# EAGLE design F9P_Carrier_Board (EAGLE 9.6.2)
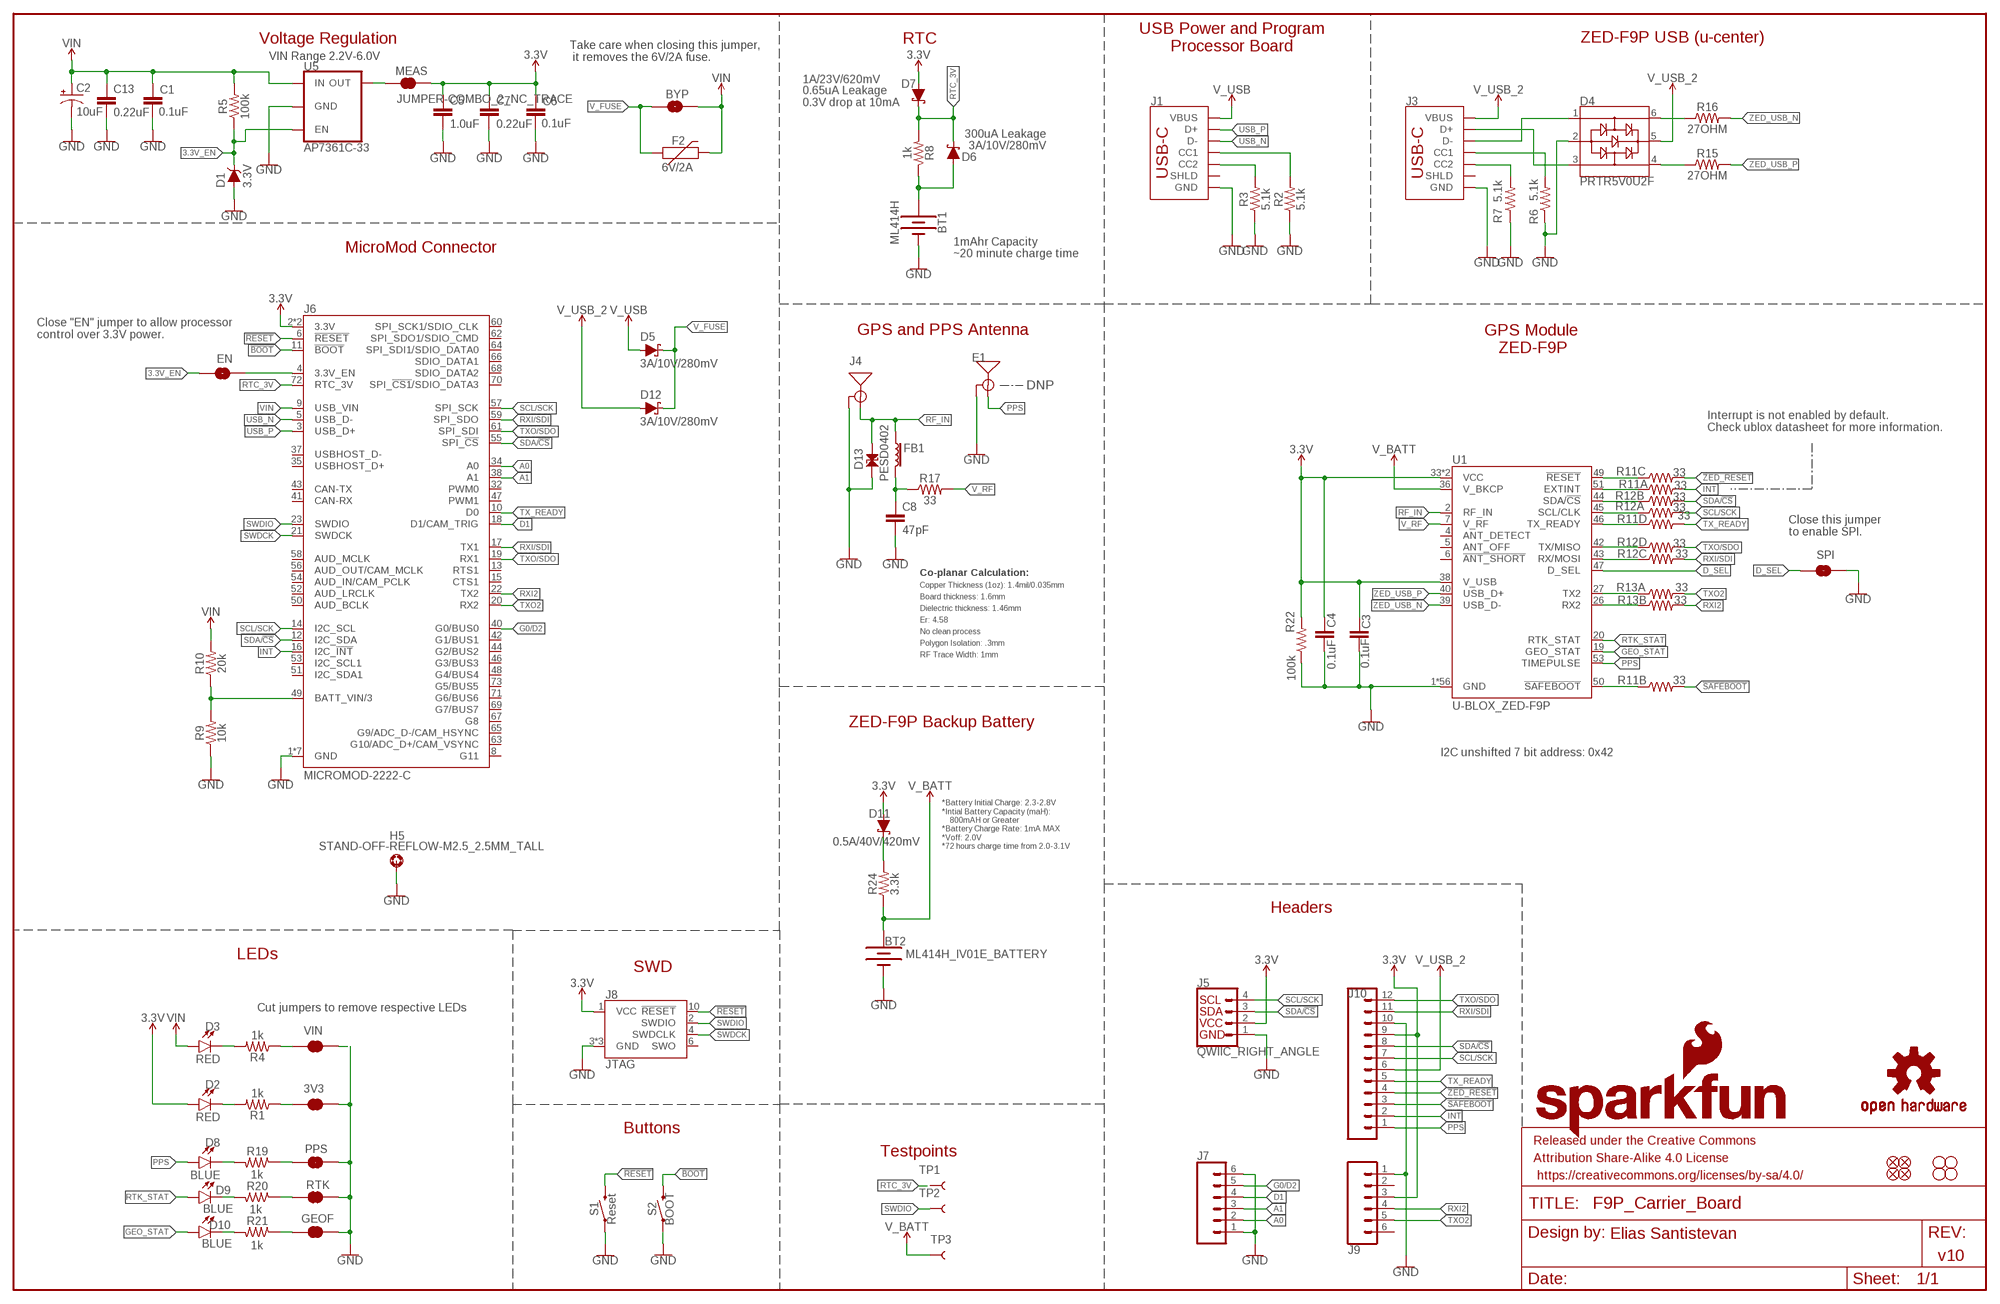
[diagram p0: schematic, sheet 1]

## Parts
3V3  JUMPER-SMT_2_NC_TRACE_SILK  [SMT-JUMPER_2_NC_TRACE_SILK]
BT1  ML414H  ML414H_IV01E_BATTERY  [ML414H_IV01E]
BT2  ML414H_IV01E_BATTERY  [ML414H_IV01E]
BYP  JUMPER-SMT_2_NO_SILK  [SMT-JUMPER_2_NO_SILK]
C1  0.1uF  0.1UF-0603-25V-(+80/-20%)  [0603]
C2  10uF  10UF-POLAR-EIA3216-16V-10%(TANT)  [EIA3216]
C3  0.1uF  0.1UF-0603-25V-5%  [0603]
C4  0.1uF  0.1UF-0603-25V-5%  [0603]
C5  1.0uF  1.0UF-0603-16V-10%  [0603]
C6  0.1uF  0.1UF-0603-25V-(+80/-20%)  [0603]
C7  0.22uF  0.22UF-0603-25V-10%  [0603]
C8  47pF  47PF-0603-50V-5%  [0603]
C13  0.22uF  0.22UF-0603-25V-10%  [0603]
D1  3.3V  DIODE-ZENER-MM3Z3V3T1G  [SOD-323]
D2  RED  LED-RED0603  [LED-0603]
D3  RED  LED-RED0603  [LED-0603]
D4  PRTR5V0U2F  [SOT886]
D5  3A/10V/280mV  DIODE-SCHOTTKY-BAT60A  [SOD-323]
D6  3A/10V/280mV  DIODE-SCHOTTKY-BAT60A  [SOD-323]
D7  1A/23V/620mV  DIODE-SCHOTTKY-BAT20J  [SOD-323]
D8  BLUE  LED-BLUE0603  [LED-0603]
D9  BLUE  LED-BLUE0603  [LED-0603]
D10  BLUE  LED-BLUE0603  [LED-0603]
D11  0.5A/40V/420mV  DIODE-SCHOTTKY-PMEG4005EJ  [SOD-323]
D12  3A/10V/280mV  DIODE-SCHOTTKY-BAT60A  [SOD-323]
D13  PESD0402  [0402]
E1  ANTENNA-SMA-GROUNDEDEDGE_SMA  [SMA-EDGE]
EN  JUMPER-SMT_2_NO_SILK  [SMT-JUMPER_2_NO_SILK]
F2  6V/2A  PPTC_6V2A  [1210]
FB1  FERRITE_BEAD-120_OHM-0402T  [0402-TIGHT]
FD1  FIDUCIALUFIDUCIAL  [FIDUCIAL-MICRO]
FD2  FIDUCIALUFIDUCIAL  [FIDUCIAL-MICRO]
FD3  FIDUCIALUFIDUCIAL  [FIDUCIAL-MICRO]
FD4  FIDUCIALUFIDUCIAL  [FIDUCIAL-MICRO]
FRAME1  FRAME-LEDGER  [CREATIVE_COMMONS]
GEOF  JUMPER-SMT_2_NC_TRACE_SILK  [SMT-JUMPER_2_NC_TRACE_SILK]
H1  STAND-OFFTIGHT  [STAND-OFF-TIGHT]
H2  STAND-OFFTIGHT  [STAND-OFF-TIGHT]
H3  STAND-OFFTIGHT  [STAND-OFF-TIGHT]
H4  STAND-OFFTIGHT  [STAND-OFF-TIGHT]
H5  STAND-OFF-REFLOW-M2.5_2.5MM_TALL  [STAND-OFF-REFLOW-M2.5]
J1  USB_C_2-LAYER_PADS  [USB-C-16P-2LAYER-PADS]
J3  USB_C_2-LAYER_PADS  [USB-C-16P-2LAYER-PADS]
J4  U.FL  ANTENNA-SMA-GROUNDEDEDGE_SMA  [SMA-EDGE]
J5  QWIIC_RIGHT_ANGLE  QWIIC_CONNECTORJS-1MM  [JST04_1MM_RA]
J6  MICROMOD-2222-C  [M.2-CONNECTOR-E]
J7  CONN_06NO_SILK_NO_POP  [1X06_NO_SILK]
J8  JTAG  CORTEX_JTAG_DEBUG_MINIMUM_PTH  [2X5-PTH-1.27MM]
J9  CONN_06NO_SILK_NO_POP  [1X06_NO_SILK]
J10  CONN_12NO_SILK  [1X12_NO_SILK]
LOGO1  SFE_LOGO_NAME_FLAME.3_INCH  [SFE_LOGO_NAME_FLAME_.3]
LOGO3  OSHW-LOGOMINI  [OSHW-LOGO-MINI]
MEAS  JUMPER-COMBO_2_NC_TRACE  [COMBO-JUMPER_2_NC_TRACE]
PPS  JUMPER-SMT_2_NC_TRACE_SILK  [SMT-JUMPER_2_NC_TRACE_SILK]
R1  1k  1KOHM-0603-1/10W-1%  [0603]
R2  5.1k  5.1KOHM5.1KOHM-0603-1/10W-1%  [0603]
R3  5.1k  5.1KOHM5.1KOHM-0603-1/10W-1%  [0603]
R4  1k  1KOHM-0603-1/10W-1%  [0603]
R5  100k  100KOHM-0603-1/10W-1%  [0603]
R6  5.1k  5.1KOHM5.1KOHM-0603-1/10W-1%  [0603]
R7  5.1k  5.1KOHM5.1KOHM-0603-1/10W-1%  [0603]
R8  1k  1KOHM-0603-1/10W-1%  [0603]
R9  10k  10KOHM-0603-1/10W-1%  [0603]
R10  20k  20KOHM-0603-1/10W-1%  [0603]
R11  33  33OHM_RA-1206-1/16W-5%  [1206_RA]
R12  33  33OHM_RA-1206-1/16W-5%  [1206_RA]
R13  33  33OHM_RA-1206-1/16W-5%  [1206_RA]
R15  27OHM  [0402-TIGHT]
R16  27OHM  [0402-TIGHT]
R17  33  33OHM-0603-1/10W-1%  [0603]
R19  1k  1KOHM-0603-1/10W-1%  [0603]
R20  1k  1KOHM-0603-1/10W-1%  [0603]
R21  1k  1KOHM-0603-1/10W-1%  [0603]
R22  100k  100KOHM-0603-1/10W-1%  [0603]
R24  3.3k  3.3KOHM-0603-1/10W-1%  [0603]
RTK  JUMPER-SMT_2_NC_TRACE_SILK  [SMT-JUMPER_2_NC_TRACE_SILK]
S1  Reset  MOMENTARY-SWITCH-SPST-SMD-5.2-TALL-REDUNDANT  [TACTILE_SWITCH_SMD_5.2MM]
S2  BOOT  MOMENTARY-SWITCH-SPST-SMD-5.2-TALL-REDUNDANT  [TACTILE_SWITCH_SMD_5.2MM]
SPI  JUMPER-SMT_2_NO_SILK  [SMT-JUMPER_2_NO_SILK]
TP1  TEST-POINT3X5  [PAD.03X.05]
TP2  TEST-POINT3X5  [PAD.03X.05]
TP3  TEST-POINT3X5  [PAD.03X.05]
U1  U-BLOX_ZED-F9P  [ZED-F9P]
U5  AP7361C-33  AP7361C-33FGEUDFN-8  [UDFN-8]
VIN  JUMPER-SMT_2_NC_TRACE_SILK  [SMT-JUMPER_2_NC_TRACE_SILK]

## Nets
3.3V: C3.1 C4.1 C5.1 C6.1 C7.1 D2.A D7.A D11.A J5.2 J6.2(3.3V) J6.74(3.3V) J8.1(VCC) J9.3 J10.9 MEAS.2 MEAS.4 R22.2 U1.33(VCC) U1.34(VCC) U1.38(V_USB)
3.3V_EN: D1.C EN.1 R5.1 U5.5(EN)
!BOOT!: J6.11(!BOOT!) S2.3 S2.4
!RESET!: J6.6(!RESET!) J8.10(!RESET) S1.3 S1.4
!SAFEBOOT!: J10.3 R11.P7
!ZED_RESET!: J10.4 R11.P6
A0: J6.34(A0) J7.2
A1: J6.38(A1) J7.3
D1: J6.18(D1/CAM_TRIG) J7.4
D_SEL: SPI.1 U1.47(D_SEL)
G0/D2: J6.40(G0/BUS0) J7.5
GEO_STAT: D10.A U1.19(GEO_STAT)
GND: 3V3.2 BT1.- BT2.- C1.2 C2.- C3.2 C4.2 C5.2 C6.2 C7.2 C8.2 C13.2 D1.A D4.2 D13.1 E1.GND@0(GND) E1.GND@1(GND) E1.GND@2(GND) E1.GND@3(GND) GEOF.1 H5.1 J1.GND J1.GND2(GND) J3.GND J3.GND2(GND) J4.GND@0(GND) J4.GND@1(GND) J4.GND@2(GND) J4.GND@3(GND) J5.1 J6.1(GND) J6.7(GND) J6.33(GND) J6.36(GND) J6.39(GND) J6.45(GND) J6.75(GND) J7.1 J7.6 J8.3(GND) J8.5(GND) J8.9(GND) J9.1 J10.10 PPS.1 R2.1 R3.1 R6.1 R7.1 R9.1 R22.1 RTK.1 S1.1 S1.2 S2.1 S2.2 SPI.2 U1.1(GND) U1.3(GND) U1.12(GND) U1.14(GND) U1.32(GND) U1.37(GND) U1.41(GND) U1.48(GND) U1.55(GND) U1.56(GND) U1.57(GND) U1.58(GND) U1.59(GND) U1.60(GND) U1.61(GND) U1.62(GND) U1.63(GND) U1.64(GND) U1.65(GND) U1.66(GND) U1.67(GND) U1.68(GND) U1.69(GND) U1.70(GND) U1.71(GND) U1.72(GND) U1.73(GND) U1.74(GND) U1.75(GND) U1.76(GND) U1.77(GND) U1.78(GND) U1.79(GND) U1.80(GND) U1.81(GND) U1.82(GND) U1.83(GND) U1.84(GND) U1.85(GND) U1.86(GND) U1.87(GND) U1.88(GND) U1.89(GND) U1.90(GND) U1.91(GND) U1.92(GND) U1.93(GND) U1.94(GND) U1.95(GND) U1.96(GND) U1.97(GND) U1.98(GND) U1.99(GND) U1.100(GND) U1.101(GND) U1.102(GND) U5.4(GND) U5.EP(GND) VIN.2
INT: J6.16(I2C_!INT!) J10.2 R11.P8
N$1: D2.C R1.2
N$2: R4.1 VIN.1
N$3: 3V3.1 R1.1
N$4: D3.C R4.2
N$5: EN.2 J6.4(3.3V_EN)
N$6: J3.A5(CC1) R6.2
N$7: J3.B5(CC2) R7.2
N$8: R20.1 RTK.2
N$9: D4.6 R16.1
N$10: J1.A5(CC1) R2.2
N$11: J1.B5(CC2) R3.2
N$12: D4.3 J3.A6(D+) J3.B6(D+)
N$13: D4.1 J3.A7(D-) J3.B7(D-)
N$14: BT1.+ D6.A R8.1
N$15: R11.P1 U1.51(EXTINT)
N$16: R11.P2 U1.50(!SAFEBOOT!)
N$17: D4.4 R15.1
N$18: C8.1 FB1.2 R17.1
N$19: R11.P3 U1.49(!RESET!)
N$20: R11.P4 U1.46(TX_READY)
N$21: R12.P1 U1.45(SCL/CLK)
N$22: R12.P2 U1.44(SDA/!CS!)
N$23: R12.P3 U1.43(RX/MOSI)
N$24: R12.P4 U1.42(TX/MISO)
N$25: R13.P1 U1.27(TX2)
N$26: R13.P2 U1.26(RX2)
N$27: PPS.2 R19.1
N$28: D8.C R19.2
N$29: D9.C R20.2
N$32: D11.C R24.2
N$45: GEOF.2 R21.1
N$46: D10.C R21.2
OUT_MEAS: MEAS.1 MEAS.3 U5.1(OUT)
PPS: D8.A E1.SIG(SIGNAL) J10.1 U1.53(TIMEPULSE)
RF_IN [Antenna]: D13.2 FB1.1 J4.SIG(SIGNAL) U1.2(RF_IN)
RTC_3V: D6.C D7.C J6.72(RTC_3V) R8.2 TP1.1
RTK_STAT: D9.A U1.20(RTK_STAT)
RXI2: J6.22(TX2) J9.4 R13.P7
RXI/SDI: J6.17(TX1) J6.59(SPI_SDO) J10.11 R12.P6
SCL/SCK: J5.4 J6.14(I2C_SCL) J6.57(SPI_SCK) J10.7 R12.P8
SDA/!CS!: J5.3 J6.12(I2C_SDA) J6.55(SPI_!CS!) J10.8 R12.P7
SWDCK: J6.21(SWDCK) J8.4(SWDCLK)
SWDIO: J6.23(SWDIO) J8.2(SWDIO) TP2.1
TX_READY: J6.10(D0) J10.5 R11.P5
TXO2: J6.20(RX2) J9.5 R13.P8
TXO/SDO: J6.19(RX1) J6.61(SPI_SDI) J10.12 R12.P5
USB_N [Diff pairs]: J1.A7(D-) J1.B7(D-) J6.5(USB_D-)
USB_P [Diff pairs]: J1.A6(D+) J1.B6(D+) J6.3(USB_D+)
V_BATT: BT2.+ R24.1 TP3.1 U1.36(V_BKCP)
V_FUSE: BYP.1 D5.C D12.C F2.1
V_RF: R17.2 U1.7(V_RF)
V_USB: D5.A J1.VBUS1(VBUS) J1.VBUS2(VBUS)
V_USB_2: D4.5 D12.A J3.VBUS1(VBUS) J3.VBUS2(VBUS) J10.6
VIN: BYP.2 C1.1 C2.+ C13.1 D3.A F2.2 J6.9(USB_VIN) R5.2 R10.2 U5.8(IN)
VIN/3: J6.49(BATT_VIN/3) R9.2 R10.1
ZED_USB_N: R16.2 U1.39(USB_D-)
ZED_USB_P: R15.2 U1.40(USB_D+)
Unconnected: J1.SHLD1(SHLD) J1.SHLD2(SHLD) J1.SHLD3(SHLD) J1.SHLD4(SHLD) J3.SHLD1(SHLD) J3.SHLD2(SHLD) J3.SHLD3(SHLD) J3.SHLD4(SHLD) J6.8(G11) J6.13(RTS1) J6.15(CTS1) J6.32(PWM0) J6.35(USBHOST_D+) J6.37(USBHOST_D-) J6.41(CAN-RX) J6.42(G1/BUS1) J6.43(CAN-TX) J6.44(G2/BUS2) J6.46(G3/BUS3) J6.47(PWM1) J6.48(G4/BUS4) J6.50(AUD_BCLK) J6.51(I2C_SDA1) J6.52(AUD_LRCLK) J6.53(I2C_SCL1) J6.54(AUD_IN/CAM_PCLK) J6.56(AUD_OUT/CAM_MCLK) J6.58(AUD_MCLK) J6.60(SPI_SCK1/SDIO_CLK) J6.62(SPI_SDO1/SDIO_CMD) J6.63(G10/ADC_D+/CAM_VSYNC) J6.64(SPI_SDI1/SDIO_DATA0) J6.65(G9/ADC_D-/CAM_HSYNC) J6.66(SDIO_DATA1) J6.67(G8) J6.68(SDIO_DATA2) J6.69(G7/BUS7) J6.70(SPI_!CS1!/SDIO_DATA3) J6.71(G6/BUS6) J6.73(G5/BUS5) J8.6(SWO) J9.2 J9.6 R13.P3 R13.P4 R13.P5 R13.P6 U1.4(ANT_DETECT) U1.5(ANT_OFF) U1.6(!ANT_SHORT!)

## Notes on the sheet
- USB Power and Program
  Processor Board
- Voltage Regulation | RTC | ZED-F9P USB (u-center)
- VIN Range 2.2V-6.0V
- Take care when closing this jumper,
   it removes the 6V/2A fuse.
- 0.65uA Leakage
  0.3V drop at 10mA
- 300uA Leakage
- MicroMod Connector | 1mAhr Capacity
- ~20 minute charge time
- GPS and PPS Antenna
- Close "EN" jumper to allow processor
  control over 3.3V power.
- GPS Module 
  ZED-F9P
- DNP
- Interrupt is not enabled by default.
  Check ublox datasheet for more information.
- Close this jumper 
  to enable SPI.
- Co-planar Calculation:
- Copper Thickness (1oz): 1.4mil/0.035mm
- Board thickness: 1.6mm
- Dielectric thickness: 1.46mm
- Er: 4.58
- No clean process
- Polygon Isolation: .3mm
- RF Trace Width: 1mm
- ZED-F9P Backup Battery
- I2C unshifted 7 bit address: 0x42
- *Battery Initial Charge: 2.3-2.8V
  *Intial Battery Capacity (maH): 
      800mAH or Greater
  *Battery Charge Rate: 1mA MAX
  *Voff: 2.0V
  *72 hours charge time from 2.0-3.1V
- Headers
- LEDs
- SWD
- Cut jumpers to remove respective LEDs
- Buttons
- Testpoints
- 1k
- 1k
- Elias Santistevan
- 1k
- v10

## Library data of the parts
3V3 GEOF PPS RTK VIN = SparkFun-Jumpers:JUMPER-SMT_2_NC_TRACE: Normally closed trace jumper This jumper has a trace between two pads so it's normally closed (NC). Use a razor knife to open the connection. For best results follow the IPC guidelines for cutting traces: Cutout at least 0.063 mm (0.005 in). Remove all loose material to clean up the cut area. Seal the cut with an approved epoxy. Reapply solder to reclose the connection.
BT1 BT2 = SparkFun-Batteries:ML414H_IV01E_BATTERY: SEIKO ML414H-IV01E Reflowable Lithium Battery ML414H is a rechargeable, coin type battery with features such as Pb-free reflowable (Peak temperature: 260 C) and high temperature heat resistance. Battery Characteristics: 3.1V max voltage Voff is 2V 1mAH 3k series resistor with battery 72 hour charge time from 2.0-3.1V 2.3-2.8V initial charge; PROD_ID: BATT-14267
BYP EN SPI = SparkFun-Jumpers:JUMPER-SMT_2_NO: Normally open jumper This jumper has two pads in close proximity to each other. Apply solder to close the connection. Round pads are easier to solder for beginners, but are a lot larger. SparkFun Product that uses the round pads: SparkFun EL Sequencer <https://www.sparkfun.com/products/12781>
C1 C6 = SparkFun-Capacitors:0.1UF: 0.1µF ceramic capacitors A capacitor is a passive two-terminal electrical component used to store electrical energy temporarily in an electric field.; PROD_ID: CAP-00810
C2 = SparkFun-Capacitors:10UF-POLAR: 10.0µF polarized capacitors A capacitor is a passive two-terminal electrical component used to store electrical energy temporarily in an electric field.; PROD_ID: CAP-00811
C3 C4 = SparkFun-Capacitors:0.1UF: 0.1µF ceramic capacitors A capacitor is a passive two-terminal electrical component used to store electrical energy temporarily in an electric field.; PROD_ID: CAP-08604
C5 = SparkFun-Capacitors:1.0UF: 1µF ceramic capacitors A capacitor is a passive two-terminal electrical component used to store electrical energy temporarily in an electric field.; PROD_ID: CAP-00868
C7 C13 = SparkFun-Capacitors:0.22UF: 0.22µF ceramic capacitors A capacitor is a passive two-terminal electrical component used to store electrical energy temporarily in an electric field.; PROD_ID: CAP-07822
C8 = SparkFun-Capacitors:47PF: 47pF ceramic capacitors A capacitor is a passive two-terminal electrical component used to store electrical energy temporarily in an electric field.; PROD_ID: CAP-08913
D1 = SparkFun-DiscreteSemi:DIODE-ZENER: Zener Diode A Zener diode allows current to flow from its anode to its cathode like a normal semiconductor diode, but it also permits current to flow in the reverse direction when its "Zener voltage" is reached. - WIkipedia; PROD_ID: DIO-11284
D2 D3 = SparkFun-LED:LED-RED: Red SMD LED Used in manufacturing of most products at SparkFun Packages: 0603 - SMD 0603 package [Product Link] <http://docs.avagotech.com/docs/AV02-0551EN> 0603 SMART - SMD 0603 SMART package ( more efficient and expensive)[Product Link] <http://www.osram-os.com/Graphics/XPic2/00077099_0.pdf> 1206 - SMD1206 package [Product Link] <https://www.sparkfun.com/datasheets/DevTools/LilyPad/Q150OVS4.pdff> SparkFun Products: Pro Mini 328 -5V <https://www.sparkfun.com/products/821> RedBoard <https://www.sparkfun.com/products/12757> IOIO-OTG <https://www.sparkfun.com/products/13613>; PROD_ID: DIO-00819
D4 = SparkFun-IC-Power:PRTR5V0U2: A small ESD protection device. Most commonly used on USB D+/D- signals to protect large, expensive, or especially sensitive USB enabled devices.; PROD_ID: DIO-14084
D5 D6 D12 = SparkFun-DiscreteSemi:DIODE-SCHOTTKY: Schottky diode A Schottky diode is a semiconductor diode which has a low forward voltage drop and a very fast switching action.; PROD_ID: DIO-14072
D7 = SparkFun-DiscreteSemi:DIODE-SCHOTTKY: Schottky diode A Schottky diode is a semiconductor diode which has a low forward voltage drop and a very fast switching action.; PROD_ID: DIO-11623
D8-D10 = SparkFun-LED:LED-BLUE: Blue SMD LED Used in manufacturing of various products at SparkFun Packages: 0603 - SMD 0603 package [Product Link] <http://www.digikey.com/product-detail/en/SMLE12BC7TT86/511-1589-2-ND/1641808> 1206 - SMD1206 package [Product Link] <http://www.digikey.com/product-detail/en/lite-on-inc/LTST-C150TBKT/160-1643-1-ND/573584> SparkFun Products: ESP8266 Thing-Dev Board <https://www.sparkfun.com/products/13711> RedBoard <https://www.sparkfun.com/products/12757>; PROD_ID: DIO-08575
D11 = SparkFun-DiscreteSemi:DIODE-SCHOTTKY: Schottky diode A Schottky diode is a semiconductor diode which has a low forward voltage drop and a very fast switching action.; PROD_ID: DIO-10955
D13 = SparkFun-DiscreteSemi:PESD0402: ESD protection diode PESD is used to protect a signal line from ESD.; DIGIKEY_PART: PESD0402-140CT-ND; MOUSE_PART: 650-PESD0402-140; PROD_ID: DIO-15359
E1 J4 = SparkFun-RF:ANTENNA-SMA-GROUNDED: SMA Antenna Connector w/ Ground Edge-mount and SMD SMA connectors for RF Antennas. **4-LAYER BOARD WARNING!!** When designing a 4-layer board using any of the SMD variants, you will need to manually add a cutout polygon on any internal power layers to make sure that you don't end up with exposed copper around the edge of the routed hole for these connectors. Exposed power copper could then short to the connector body - and that would be bad. Why hasn't anyone added the cutout polygons directly to the connector footprint? Well, your internal layers (usually 2 and 15) may be covered with GND polygons and you might well want the copper to go all the way to the edge, especially under the connector SIGNAL pin. So adding cutouts to the footprint might make matters worse, not better...; PROD_ID: CONN-08289
F2 = SparkFun-Fuses:PPTC: Resettable Fuse PPTC Resettable Fuse. Really a sort of resistor with a polymeric positive temperature coefficient whose resistance increases dramatically with an increase in temperature. When heated by the power passing through the resistance rises causing the current to be limited, protecting the circuit. This is achieved by the transition of the polymer from a crystalline to an amorphous state where the conductive carbon separates breaking the conductive pathways found in the cool crystalline structure. When a PPTC cools back down it resumes conducting letting the circuit turn back on. SparkFun Products: SparkFun RedBoard - Programmed with Arduino <https://www.sparkfun.com/products/12757> Pro Micro - 5V/16MHz <https://www.sparkfun.com/products/12640> Arduino Pro 328 - 5V/16MHz <https://www.sparkfun.com/products/10915> MP3 Trigger <https://www.sparkfun.com/products/13720>; PROD_ID: RES-14313
FB1 = SparkFun-Coils:FERRITE_BEAD-120_OHM: Ferrite Bead (blocks, cores, rings, chokes, etc.) Inductor with layers of ferrite used to suppress high frequencies. Often used to isolate high frequency noise.; PROD_ID: NDUC-14206
FD1-FD4 = SparkFun-Aesthetics:FIDUCIAL: Fiducial Alignment Points Point-of-reference for pick-and-place machines and other optical instruments.
FRAME1 = SparkFun-Aesthetics:FRAME-LEDGER: Schematic Frame - Ledger Standard 11x14 US Ledger frame
H1-H4 = SparkFun-Hardware:STAND-OFF: Stand Off Drill holes for mechanically mounting via screws, standoffs, etc. Note: Use the keepout ring to avoid running the screw head into surrounding components. Variant Overviews STAND-OFF - Mechanical footprint for a #4 phillips button head screw. STAND-OFF-TIGHT - Mechanical footprint for a #4 phillips button head screw, Example SparkFun Products Screw - Phillips Head (1/4", 4-40, 10 pack) <https://www.sparkfun.com/products/10453> (PRT-10453) Screw - Phillips Head (1/2", 4-40, 10 pack) <https://www.sparkfun.com/products/10452> (PRT-10452) Screw - Phillips Head (3/4", 4-40, 10 pack) <https://www.sparkfun.com/products/10451> (PRT-10451) Screw - Phillips Head (1", 4-40, 10 pack) <https://www.sparkfun.com/products/10450> (PRT-10450)
H5 = SparkFun-Hardware:STAND-OFF-REFLOW: Stand Off Reflow Compatible A metal standoff that can be placed and reflowed onto a PCB. The M2.5 x 2.5mm variant is used on MicroMod. The M2.0 x 6.0mm variant is used to mount the Iridium 9603N modem.; PROD_ID: HW-14899
J1 J3 = SparkFun-Connectors:USB_C: USB Type C 16Pin Connector Super Speed pins not available on the 16-pin purely SMD connector so this part is best for USB 2.0 implementations. D1 and D2 are tied together enabling D+/- no matter which way the cable is plugged into the connector. The two channel configuration pins (CC1/2) are exposed. These are normally connected to ground via 5.1k resistors but can be reconfigured for high current/high power applications. **4-LAYER BOARD WARNING!!** If designing 4-layer board, make sure to select the variant _4-LAYER-ISOLATED. The linked footprint (USB-C-16-4LAYER-ISOLATED) includes some very necessary cutout polygons in the inner layers (2 and 15). This prevents the PTH mounting shield legs on the USB connector from electrically connecting any other polygons on the inner layers (usually VCC and GND).; PROD_ID: CONN-14122
J5 = SparkFun-Connectors:QWIIC_CONNECTOR: SparkFun I2C Standard Qwiic Connector An SMD 1mm pitch JST connector makes it easy and quick (get it? Qwiic?) to connect I2C devices to each other. The Qwiic system <http://www.sparkfun.com/qwiic> enables fast and solderless connection between popular platforms and various sensors and actuators. We carry 200mm <https://www.sparkfun.com/products/14204>, 100mm <https://www.sparkfun.com/products/14205>, 50mm <https://www.sparkfun.com/products/14206>, and breadboard friendly <https://www.sparkfun.com/products/14207> Qwiic cables. We also offer 10 pcs strips <https://www.sparkfun.com/products/14323> the SMD connectors.; PROD_ID: CONN-13694
J6 = SparkFun-MicroMod:MICROMOD: MicroMod Connector Description: A card edge connector and mating PCB connector to allow various MicroMod Processor Boards to be coupled with various carrier boards of different capabilities. Based on the M.2 standard.; PROD_ID: CONN-14877
J7 J9 = SparkFun-Connectors:CONN_06: Multi connection point. Often used as Generic Header-pin footprint for 0.1 inch spaced/style header connections On any of the 0.1 inch spaced packages, you can populate with these: Break Away Headers - Straight <https://www.sparkfun.com/products/116> (PRT-00116) Break Away Male Headers - Right Angle <https://www.sparkfun.com/products/553> (PRT-00553) Female Headers <https://www.sparkfun.com/products/115> (PRT-00115) Break Away Headers - Machine Pin <https://www.sparkfun.com/products/117> (PRT-00117) Break Away Female Headers - Swiss Machine Pin <https://www.sparkfun.com/products/743> (PRT-00743) Arduino Stackable Header - 6 Pin <https://www.sparkfun.com/products/9280> (PRT-09280) For SCREWTERMINALS and SPRING TERMINALS visit here: Screw Terimnals on SparkFun.com <https://www.sparkfun.com/search/results?term=Screw+Terminals> (5mm/3.5mm/2.54mm spacing) This device is also useful as a general connection point to wire up your design to another part of your project. Our various solder wires solder well into these plated through hole pads. Hook-Up Wire - Assortment (Stranded, 22 AWG) <https://www.sparkfun.com/products/11375> (PRT-11375) Hook-Up Wire - Assortment (Solid Core, 22 AWG) <https://www.sparkfun.com/products/11367> (PRT-11367) View the entire wire category on our website here <https://www.sparkfun.com/categories/141>
J8 = SparkFun-Connectors:CORTEX_JTAG_DEBUG_MINIMUM: Cortex Debug Connector - 10 pin Supports JTAG debug, Serial Wire debug, and Serial Wire Viewer. PTH and SMD connector options available. General Connector Information <http://infocenter.arm.com/help/topic/com.arm.doc.faqs/attached/13634/cortex_debug_connectors.pdf> Products: PTH Connector <http://www.digikey.com/product-detail/en/cnc-tech/3220-10-0100-00/1175-1627-ND/3883661> -via Digi-Key SparkFun PSoc <https://www.sparkfun.com/products/13229> SparkFun T <https://www.sparkfun.com/products/13810>
J10 = SparkFun-Connectors:CONN_12: Multi connection point. Often used as Generic Header-pin footprint for 0.1 inch spaced/style header connections On any of the 0.1 inch spaced packages, you can populate with these: Break Away Headers - Straight <https://www.sparkfun.com/products/116> (PRT-00116) Break Away Male Headers - Right Angle <https://www.sparkfun.com/products/553> (PRT-00553) Female Headers <https://www.sparkfun.com/products/115> (PRT-00115) Break Away Headers - Machine Pin <https://www.sparkfun.com/products/117> (PRT-00117) Break Away Female Headers - Swiss Machine Pin <https://www.sparkfun.com/products/743> (PRT-00743) For SCREWTERMINALS and SPRING TERMINALS visit here: Screw Terimnals on SparkFun.com <https://www.sparkfun.com/search/results?term=Screw+Terminals> (5mm/3.5mm/2.54mm spacing) This device is also useful as a general connection point to wire up your design to another part of your project. Our various solder wires solder well into these plated through hole pads. Hook-Up Wire - Assortment (Stranded, 22 AWG) <https://www.sparkfun.com/products/11375> (PRT-11375) Hook-Up Wire - Assortment (Solid Core, 22 AWG) <https://www.sparkfun.com/products/11367> (PRT-11367) View the entire wire category on our website here <https://www.sparkfun.com/categories/141> Special notes: Molex polarized connector foot print use with SKU : PRT-08231 with associated crimp pins and housings. 1MM SMD Version SKU: PRT-10208 NOTES ON THE VARIANTS LOCK and LOCK_LONGPADS... This footprint was designed to help hold the alignment of a through-hole component (i.e. 6-pin header) while soldering it into place. You may notice that each hole has been shifted either up or down by 0.005 of an inch from it's more standard position (which is a perfectly straight line). This slight alteration caused the pins (the squares in the middle) to touch the edges of the holes. Because they are alternating, it causes a "brace" to hold the component in place. 0.005 has proven to be the perfect amount of "off-center" position when using our standard breakaway headers. Although looks a little odd when you look at the bare footprint, once you have a header in there, the alteration is very hard to notice. Also,if you push a header all the way into place, it is covered up entirely on the bottom side.
LOGO1 = SparkFun-Aesthetics:SFE_LOGO_NAME_FLAME: SparkFun Font Logo w/ Flame This is the SparkFun full logo. The logo on the schematic will always be the same size; the package variant is the height of the flame part of the logo. Default layer for the logo on the board is tSilk.
LOGO3 = SparkFun-Aesthetics:OSHW-LOGO: Open-Source Hardware (OSHW) Logo This logo indicates the piece of hardware it is found on incorporates a OSHW license and/or adheres to the definition of open source hardware found here: http://freedomdefined.org/OSHW
MEAS = SparkFun-Jumpers:JUMPER-COMBO_2_NC_TRACE
R1 R4 R8 R19-R21 = SparkFun-Resistors:1KOHM: 1kΩ resistor A resistor is a passive two-terminal electrical component that implements electrical resistance as a circuit element. Resistors act to reduce current flow, and, at the same time, act to lower voltage levels within circuits. - Wikipedia; PROD_ID: RES-07856
R2 R3 R6 R7 = SparkFun-Resistors:5.1KOHM; PROD_ID: RES-12083
R5 R22 = SparkFun-Resistors:100KOHM: 100kΩ resistor A resistor is a passive two-terminal electrical component that implements electrical resistance as a circuit element. Resistors act to reduce current flow, and, at the same time, act to lower voltage levels within circuits. - Wikipedia; PROD_ID: RES-07828
R9 = SparkFun-Resistors:10KOHM: 10kΩ resistor A resistor is a passive two-terminal electrical component that implements electrical resistance as a circuit element. Resistors act to reduce current flow, and, at the same time, act to lower voltage levels within circuits. - Wikipedia; PROD_ID: RES-00824
R10 = SparkFun-Resistors:20KOHM: 20kΩ resistor A resistor is a passive two-terminal electrical component that implements electrical resistance as a circuit element. Resistors act to reduce current flow, and, at the same time, act to lower voltage levels within circuits. - Wikipedia; PROD_ID: RES-09383
R11-R13 = SparkFun-Resistors:33OHM_RA: EXB-38V330JV Four Resistory Array - AEC-Q200 Certified; PROD_ID: RES-15081
R15 R16 = SparkFun-Resistors:27OHM: 27Ω resistor A resistor is a passive two-terminal electrical component that implements electrical resistance as a circuit element. Resistors act to reduce current flow, and, at the same time, act to lower voltage levels within circuits. - Wikipedia; PROD_ID: RES-15238
R17 = SparkFun-Resistors:33OHM: 33Ω resistor A resistor is a passive two-terminal electrical component that implements electrical resistance as a circuit element. Resistors act to reduce current flow, and, at the same time, act to lower voltage levels within circuits. - Wikipedia; PROD_ID: RES-08270
R24 = SparkFun-Resistors:3.3KOHM: 3.3kΩ resistor A resistor is a passive two-terminal electrical component that implements electrical resistance as a circuit element. Resistors act to reduce current flow, and, at the same time, act to lower voltage levels within circuits. - Wikipedia; PROD_ID: RES-07851
S1 S2 = SparkFun-Switches:MOMENTARY-SWITCH-SPST: Momentary Switch (Pushbutton) - SPST Normally-open (NO) SPST momentary switches (buttons, pushbuttons). Variants PTH-12MM - 12mm square, through-hole Momentary Pushbutton Switch - 12mm Square <https://www.sparkfun.com/products/9190> (COM-09190) PTH-6.0MM, PTH-6.0MM-KIT - 6.0mm square, through-hole Mini Pushbutton Switch <https://www.sparkfun.com/products/97> (COM-00097) KIT package intended for soldering kit's - only one side of pads' copper is exposed. PTH-RIGHT-ANGLE-KIT - Right-angle, through-hole Right Angle Tactile Button <https://www.sparkfun.com/products/10791> - Used on SparkFun BigTime Watch Kit <https://www.sparkfun.com/products/11734> SMD-12MM - 12mm square, surface-mount Tactile Button - SMD (12mm) <https://www.sparkfun.com/products/12993> (COM-12993) Used on SparkFun PicoBoard <https://www.sparkfun.com/products/11888> SMD-4.5MM - 4.5mm Square Trackball Switch Used on SparkFun Blackberry Trackballer Breakout <https://www.sparkfun.com/products/13169> SMD-4.6MMX2.8MM - 4.60mm x 2.80mm, surface mount Used on SparkFun Pro Micro - RP2040 <https://www.sparkfun.com/products/17717> SMD-5.2MM, SMD-5.2-REDUNDANT - 5.2mm square, surface-mount Mini Pushbutton Switch - SMD <https://www.sparkfun.com/products/8720> (COM-08720) Used on Arduino Pro Mini <https://www.sparkfun.com/products/11114> REDUNDANT package connects both switch circuits together SMD-6.0X3.5MM - 6.0 x 3.5mm, surface mount Momentary Reset Switch SMD <https://www.sparkfun.com/products/8229> (COM-08229) SMD-6.2MM-TALL - 6.2mm square, surface mount Tactile Button - SMD (6mm) <https://www.sparkfun.com/products/12992> Used on SparkFun Digital Sandbox <https://www.sparkfun.com/products/12651> SMD-RIGHT-ANGLE - Right-angle, surface mount Used on SparkFun Block for Intel® Edison - Arduino <https://www.sparkfun.com/products/13036>; PROD_ID: SWCH-14139
TP1-TP3 = SparkFun-Connectors:TEST-POINT: SparkFun Test Points Bare copper test points for troubleshooting or In-Circuit-Testing. These are used by our Production team for verifying production board runs using pogo-pins on test beds. SparkFun Products: SparkFun LSM9DS1 Breakout <https://www.sparkfun.com/products/13284> SparkFun PSOC <https://www.sparkfun.com/products/13714> SparkFun Load Cell Amplifier <https://www.sparkfun.com/products/13879>
U1 = SparkFun-GPS:U-BLOX_ZED-F9P; PROD_ID: IC-14209
U5 = SparkFun-IC-Power:AP7361C-33FGE: AP7361C 3.3V LDO Regulator; PROD_ID: VREG-14094

## Net classes
1 Antenna: width 1 mm, clearance 0.3 mm

## Board
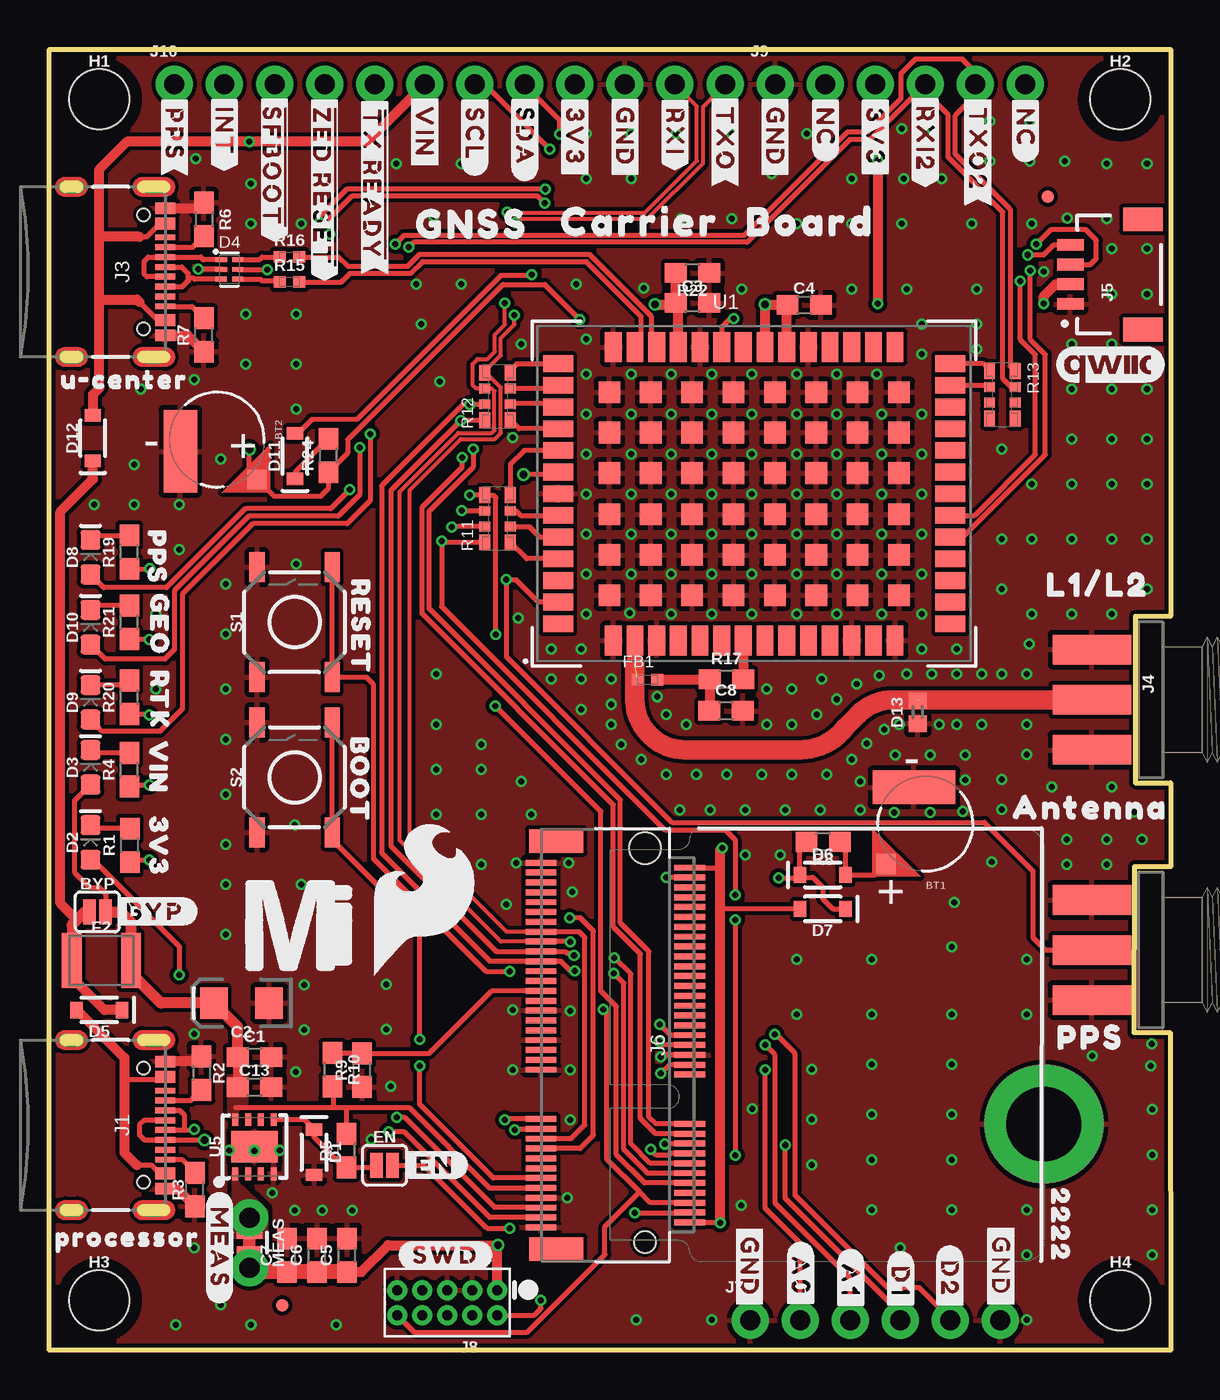
[diagram p1: board, top side]
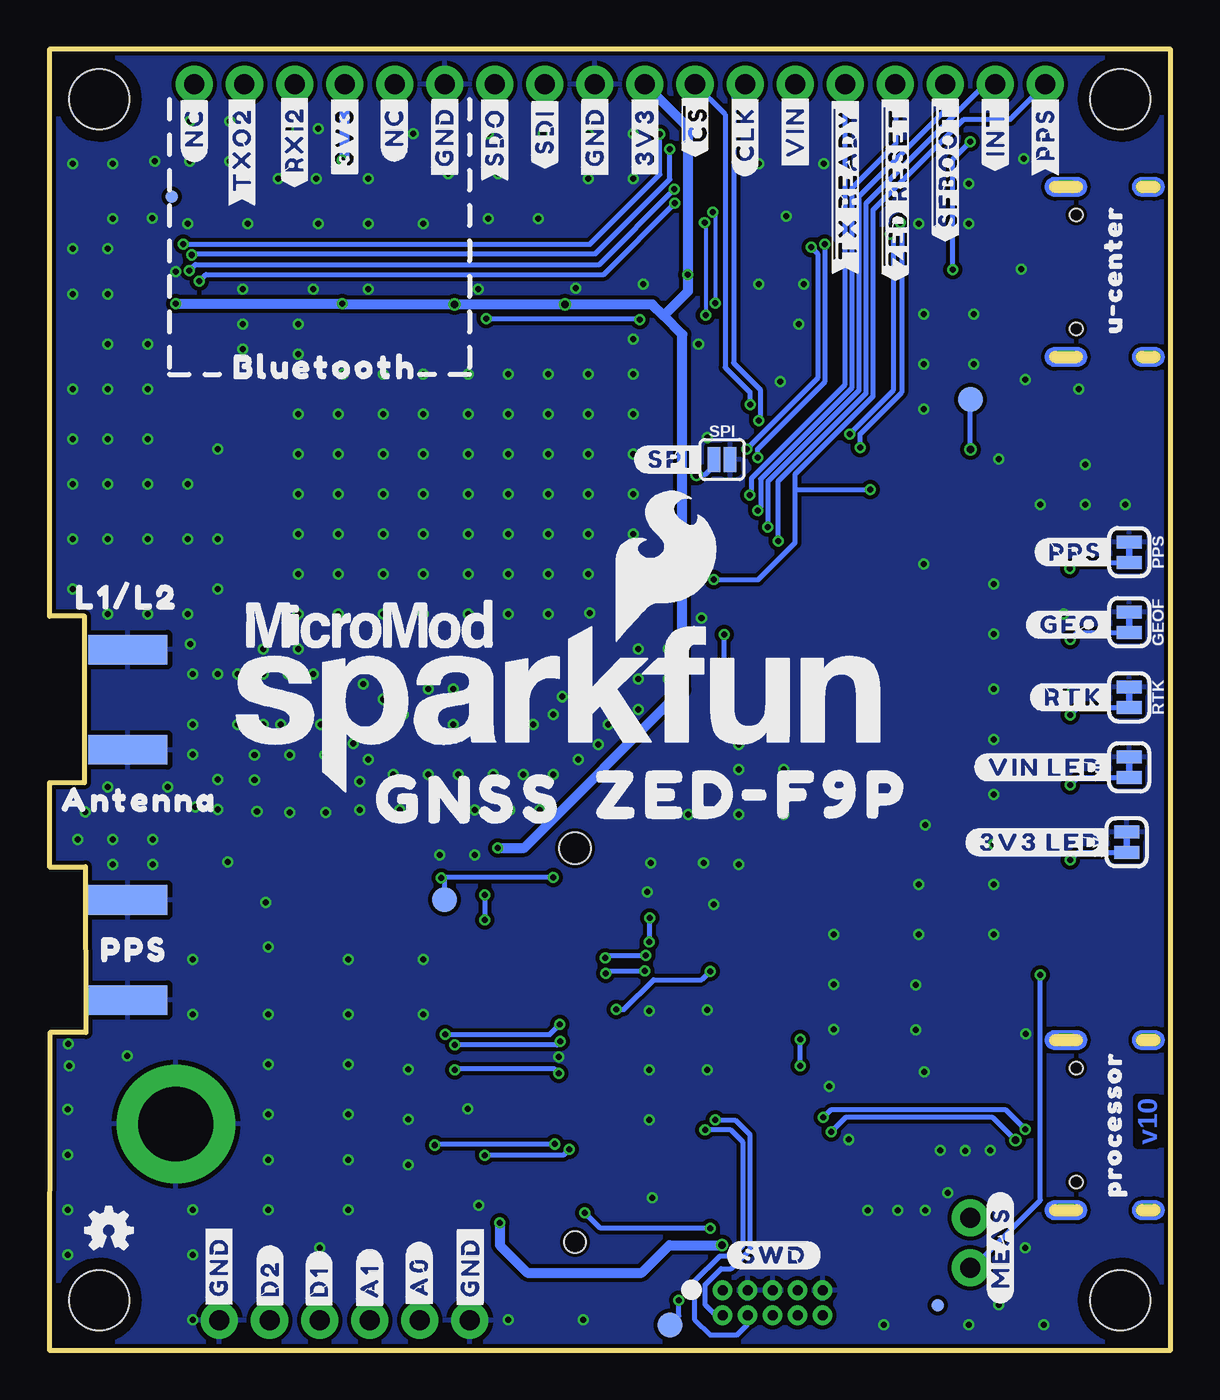
[diagram p2: board, bottom side, seen from below]

Size 56.9 x 66.04 mm. Coordinates in mm from the lower left corner, seen from the top.
Outline: 0,66.04 56.9,66.04 56.9,37.26 55.12,37.26 55.12,28.8 56.9,28.8 56.9,24.54 55.07,24.54 55.04,16.13 56.87,16.13 56.9,0 0,0 0,66.04
Copper layers (1*16): Top 0.035mm / dielectric 1.5mm / Bottom 0.035mm
Design rules "SparkFun-2-layer-FAB-LIMIT": minimum track width 4mil, minimum drill 6mil, track to track 4mil, track to pad 4mil, pad to pad 4mil, via to via 4mil, smd to smd 4mil, copper to edge 4mil, drill to drill 4mil, minimum pad ring 5mil, minimum via ring 5mil, stop-mask expansion 4mil, vias tented up to drill 25mil, thermal gap 10mil
tRestrict: area 30.6,34.8 to 31.1,34.9

### Footprints (pad centres in the part's own frame; a part is rotated, then mirrored left to right if it is on the bottom)
SMT-JUMPER_2_NC_TRACE_SILK = smd 0.66 x 1.27: 1 -0.521,0; 2 0.521,0
ML414H_IV01E = smd 1 x 1: + 2.022,2.032 | smd 4.2 x 1.7: - 0.6,-1.85
SMT-JUMPER_2_NO_SILK = smd 0.635 x 1.27: 1 -0.406,0; 2 0.406,0
0603 = smd 1.1 x 1: 1 -0.85,0; 2 0.85,0
EIA3216 = smd 1.4 x 1.6: + 1.4,0; - -1.4,0
SOD-323 = smd 0.63 x 0.83: A 1.15,0; C -1.15,0
LED-0603 = smd 1 x 1: A -0.877,0; C 0.877,0
SOT886 = smd 0.61 x 0.25: 1 -0.405,0.5 | smd 0.56 x 0.25: 2 -0.43,0; 3 -0.43,-0.5; 4 0.43,-0.5; 5 0.43,0; 6 0.43,0.5
0402 = smd 0.85 x 0.9: 1 -0.58,0; 2 0.58,0
SMA-EDGE = smd 1.5 x 4: GND@0 -2.54,0; GND@1 2.54,0; SIG 0,0 | smd 1.5 x 4 bottom: GND@2 -2.54,0; GND@3 2.54,0
1210 = smd 1 x 2.8: 1 -1.5,0; 2 1.5,0
0402-TIGHT = smd 0.6 x 0.6: 1 -0.5,0; 2 0.5,0
FIDUCIAL-MICRO = smd 0.635 x 0.635: 1 0,0
STAND-OFF-TIGHT = hole 3.048: 0,0
STAND-OFF-REFLOW-M2.5 = drill 3.8 pad 6: 1 0,0
USB-C-16P-2LAYER-PADS = smd 0.3 x 1: A5 -1.25,-0.34; A6 -0.25,-0.34; A7 0.25,-0.34; A8 1.25,-0.34; B5 1.75,-0.34; B6 0.75,-0.34; B7 -0.75,-0.34; B8 -1.75,-0.34 | smd 0.6 x 1: GND -3.225,-0.34; GND2 3.225,-0.34; VBUS1 -2.45,-0.34; VBUS2 2.45,-0.34 | drill 0.4 pad 0.6 long: SHLD1 -4.318,-0.915; SHLD2 4.318,-0.915; SHLD3 -4.318,-5.095; SHLD4 4.318,-5.095 | hole 0.65: -2.89,-1.445; 2.89,-1.445
JST04_1MM_RA = smd 0.6 x 1.35: 1 -1.5,0; 2 -0.5,0; 3 0.5,0; 4 1.5,0 | smd 1.2 x 2: NC1 2.8,-3.675; NC2 -2.8,-3.675
M.2-CONNECTOR-E = smd 0.3 x 1.55: 1 9.25,-5.275; 2 9,2.275; 3 8.75,-5.275; 4 8.5,2.275; 5 8.25,-5.275; 6 8,2.275; 7 7.75,-5.275; 8 7.5,2.275; 9 7.25,-5.275; 10 7,2.275; 11 6.75,-5.275; 12 6.5,2.275; 13 6.25,-5.275; 14 6,2.275; 15 5.75,-5.275; 16 5.5,2.275; 17 5.25,-5.275; 18 5,2.275; 19 4.75,-5.275; 20 4.5,2.275; 21 4.25,-5.275; 22 4,2.275; 23 3.75,-5.275; 32 1.5,2.275; 33 1.25,-5.275; 34 1,2.275; 35 0.75,-5.275; 36 0.5,2.275; 37 0.25,-5.275; 38 0,2.275; 39 -0.25,-5.275; 40 -0.5,2.275; 41 -0.75,-5.275; 42 -1,2.275; 43 -1.25,-5.275; 44 -1.5,2.275; 45 -1.75,-5.275; 46 -2,2.275; 47 -2.25,-5.275; 48 -2.5,2.275; 49 -2.75,-5.275; 50 -3,2.275; 51 -3.25,-5.275; 52 -3.5,2.275; 53 -3.75,-5.275; 54 -4,2.275; 55 -4.25,-5.275; 56 -4.5,2.275; 57 -4.75,-5.275; 58 -5,2.275; 59 -5.25,-5.275; 60 -5.5,2.275; 61 -5.75,-5.275; 62 -6,2.275; 63 -6.25,-5.275; 64 -6.5,2.275; 65 -6.75,-5.275; 66 -7,2.275; 67 -7.25,-5.275; 68 -7.5,2.275; 69 -7.75,-5.275; 70 -8,2.275; 71 -8.25,-5.275; 72 -8.5,2.275; 73 -8.75,-5.275; 74 -9,2.275; 75 -9.25,-5.275 | smd 1.2 x 2.75: A1 10.35,-4.5; A2 -10.35,-4.5 | hole 1.1: 10,0 | hole 1.6: -10,0
1X06_NO_SILK = drill 1.016 pad 1.88: 1 0,0; 2 2.54,0; 3 5.08,0; 4 7.62,0; 5 10.16,0; 6 12.7,0
2X5-PTH-1.27MM = drill 0.508 pad 1: 1 -2.54,-0.635; 2 -2.54,0.635; 3 -1.27,-0.635; 4 -1.27,0.635; 5 0,-0.635; 6 0,0.635; 7 1.27,-0.635; 8 1.27,0.635; 9 2.54,-0.635; 10 2.54,0.635
1X12_NO_SILK = drill 1.016 pad 1.88: 1 0,0; 2 2.54,0; 3 5.08,0; 4 7.62,0; 5 10.16,0; 6 12.7,0; 7 15.24,0; 8 17.78,0; 9 20.32,0; 10 22.86,0; 11 25.4,0; 12 27.94,0
COMBO-JUMPER_2_NC_TRACE = smd 0.635 x 1.27: 1 -0.508,0; 2 0.508,0 | drill 1.016 pad 1.88: 3 -1.27,0; 4 1.27,0
1206_RA = smd 0.8 x 0.55: P1 -1.2,-0.62; P4 1.2,-0.62; P5 1.2,0.68; P8 -1.2,0.68 | smd 0.5 x 0.55: P2 -0.4,-0.62; P3 0.4,-0.62; P6 0.4,0.68; P7 -0.4,0.68
TACTILE_SWITCH_SMD_5.2MM = smd 1.524 x 0.762: 1 -2.794,1.905; 2 2.794,1.905; 3 -2.794,-1.905; 4 2.794,-1.905
PAD.03X.05 = smd 1.27 x 1.27: 1 0,0
ZED-F9P = smd 0.85 x 1.52: 1 -7.15,-7.45; 2 -6.05,-7.45; 3 -4.95,-7.45; 4 -3.85,-7.45; 5 -2.75,-7.45; 6 -1.65,-7.45; 7 -0.55,-7.45; 8 0.55,-7.45; 9 1.65,-7.45; 10 2.75,-7.45; 11 3.85,-7.45; 12 4.95,-7.45; 13 6.05,-7.45; 14 7.15,-7.45; 28 7.15,7.45; 29 6.05,7.45; 30 4.95,7.45; 31 3.85,7.45; 32 2.75,7.45; 33 1.65,7.45; 34 0.55,7.45; 35 -0.55,7.45; 36 -1.65,7.45; 37 -2.75,7.45; 38 -3.85,7.45; 39 -4.95,7.45; 40 -6.05,7.45; 41 -7.15,7.45 | smd 1.52 x 0.85: 15 9.95,-6.6; 16 9.95,-5.5; 17 9.95,-4.4; 18 9.95,-3.3; 19 9.95,-2.2; 20 9.95,-1.1; 21 9.95,0; 22 9.95,1.1; 23 9.95,2.2; 24 9.95,3.3; 25 9.95,4.4; 26 9.95,5.5; 27 9.95,6.6; 42 -9.95,6.6; 43 -9.95,5.5; 44 -9.95,4.4; 45 -9.95,3.3; 46 -9.95,2.2; 47 -9.95,1.1; 48 -9.95,0; 49 -9.95,-1.1; 50 -9.95,-2.2; 51 -9.95,-3.3; 52 -9.95,-4.4; 53 -9.95,-5.5; 54 -9.95,-6.6 | smd 1.1 x 1.1: 55 -1.05,-1.05; 56 -3.15,-1.05; 57 -5.25,-1.05; 58 -7.35,-1.05; 59 -1.05,-3.1; 60 -3.15,-3.1; 61 -5.25,-3.1; 62 -7.35,-3.1; 63 -1.05,-5.15; 64 -3.15,-5.15; 65 -5.25,-5.15; 66 -7.35,-5.15; 67 -1.05,5.15; 68 -3.15,5.15; 69 -5.25,5.15; 70 -7.35,5.15; 71 -1.05,3.1; 72 -3.15,3.1; 73 -5.25,3.1; 74 -7.35,3.1; 75 -1.05,1.05; 76 -3.15,1.05; 77 -5.25,1.05; 78 -7.35,1.05; 79 1.05,1.05; 80 3.15,1.05; 81 5.25,1.05; 82 7.35,1.05; 83 1.05,3.1; 84 3.15,3.1; 85 5.25,3.1; 86 7.35,3.1; 87 1.05,5.15; 88 3.15,5.15; 89 5.25,5.15; 90 7.35,5.15; 91 1.05,-5.15; 92 3.15,-5.15; 93 5.25,-5.15; 94 7.35,-5.15; 95 1.05,-3.1; 96 3.15,-3.1; 97 5.25,-3.1; 98 7.35,-3.1; 99 1.05,-1.05; 100 3.15,-1.05; 101 5.25,-1.05; 102 7.35,-1.05
UDFN-8 = smd 0.3 x 0.65: 1 -0.975,-1.375; 2 -0.325,-1.375; 3 0.325,-1.375; 4 0.975,-1.375; 5 0.975,1.375; 6 0.325,1.375; 7 -0.325,1.375; 8 -0.975,1.375 | smd 2.35 x 1.6: EP 0,0

### Placement (x,y rotation side)
3V3  2.22,25.78 90 bottom
BT1  44.48,26.72 180 top
BT2  8.51,46.23 270 top
BYP  2.44,22.25 0 top
C1  10.41,14.88 0 top
C2  9.75,17.63 180 top
C3  32.64,53.16 0 top
C4  38.3,53.06 0 top
C5  15.11,4.83 90 top
C6  13.59,4.83 90 top
C7  12.06,4.83 90 top
C8  34.34,32.46 0 top
C13  10.41,13.36 0 top
D1  13.44,10.06 270 top
D2  2.1,25.78 90 top
D3  2.1,29.59 90 top
D4  9.14,54.86 0 top
D5  2.54,17.27 180 top
D6  39.24,24.13 0 top
D7  39.24,22.4 180 top
D8  2.1,40.26 90 top
D9  2.1,32.89 90 top
D10  2.1,36.7 90 top
D11  12.47,45.39 90 top
D12  2.21,46.3 90 top
D13  44.07,32.38 90 top
E1  52.91,20.32 270 top
EN  17.02,9.4 0 top
F2  2.64,19.79 0 top
FB1  30.35,34.04 0 top
FD1  11.81,2.29 0 top
FD2  50.67,58.55 0 bottom
FD3  11.81,2.29 0 bottom
FD4  50.67,58.55 0 top
FRAME1  3.05,-19.3 0 top  (outside the outline)
GEOF  2.1,36.96 270 bottom
H1  2.54,63.5 0 top
H2  54.36,63.5 0 top
H3  2.54,2.54 0 top
H4  54.36,2.54 0 top
H5  50.47,11.48 0 top
J1  6.22,11.43 270 top
J3  6.22,54.74 270 top
J4  52.91,33.02 270 top
J5  51.82,54.61 90 top
J6  30.23,15.49 270 top
J7  35.56,1.52 0 top
J8  20.19,2.41 180 top
J9  36.83,64.26 0 top
J10  6.35,64.26 0 top
LOGO1  31.11,32.51 0 bottom
LOGO3  53.87,6.1 0 bottom
MEAS  10.16,5.46 270 top
PPS  2.1,40.51 270 bottom
R1  4.09,25.63 90 top
R2  7.72,14.07 270 top
R3  7.39,8.15 90 top
R4  4.06,29.46 90 top
R5  15.09,10.13 90 top
R6  7.85,57.4 270 top
R7  7.85,51.54 90 top
R8  39.27,25.81 180 top
R9  15.88,14.22 90 top
R10  14.38,14.25 270 top
R11  22.78,42.21 90 top
R12  22.78,48.42 90 top
R13  48.33,48.5 270 top
R15  12.19,54.23 0 top
R16  12.19,55.5 0 top
R17  34.37,34.06 0 top
R19  4.06,40.51 90 top
R20  4.06,33.15 90 top
R21  4.06,36.96 90 top
R22  32.64,54.69 180 top
R24  14.17,45.42 90 top
RTK  2.1,33.15 270 bottom
S1  12.45,36.96 90 top
S2  12.45,29.08 90 top
SPI  22.75,45.22 0 bottom
TP1  36.83,22.86 0 bottom
TP2  25.4,1.27 90 bottom
TP3  10.16,48.26 0 bottom
U1  35.77,43.48 0 top
U5  10.41,10.33 0 top
U$1  [##SFBOOT##13]  11.43,60.07 90 bottom
U$2  [##SFBOOT##8]  11.43,60.07 270 top
U$3  [#3V3#1]  41.91,61.59 90 bottom
U$4  [#3V3#1]  26.67,61.59 90 bottom
U$5  [#RESET10]  15.93,36.73 270 top
U$6  [#GND#0]  29.21,61.59 90 bottom
U$7  [#GND#0]  36.83,61.59 90 bottom
U$8  [##TX_READY##13]  16.51,59.18 90 bottom
U$9  [#PPS#6]  6.35,61.72 90 bottom
U$10  [#SCL#1]  21.59,61.72 270 top
U$11  [#RXI2#9]  44.45,61.47 90 bottom
U$12  [#SDA#0]  24.13,61.59 270 top
U$13  [#TXO#5]  34.29,61.47 270 top
U$14  [#RXI#6]  31.75,61.85 270 top
U$15  [#TXO2#9]  47.12,60.96 90 bottom
U$16  [PPS15]  52.83,15.88 0 top
U$17  [#VIN#13]  19.05,61.85 90 bottom
U$18  [GEO15]  5.59,36.83 270 top
U$19  [PPS14]  5.46,40.26 270 top
U$20  [RTK16]  5.59,33.02 270 top
U$21  [ANTENNA16]  52.83,27.56 0 top
U$22  [L1#L216]  53.21,38.86 0 top
U$23  [#GEO#9]  5.08,36.83 0 bottom
U$24  [##TX_READY##7]  16.51,59.18 270 top
U$25  [MICROMOD_LOGO_.5]  40.64,36.83 0 bottom
U$26  [#PPS#10]  4.83,40.51 0 bottom
U$27  [#RTK#8]  4.95,33.15 0 bottom
U$28  [##CS##9]  24.13,62.23 90 bottom
U$29  [#INT#4]  8.89,61.85 270 top
U$30  [#SPI#11]  25.4,45.21 0 bottom
U$31  [#3V3#1]  26.67,61.59 270 top
U$32  [#3V3#1]  41.91,61.59 270 top
U$33  [#GND#0]  36.83,61.59 270 top
U$34  [#GND#0]  29.21,61.59 270 top
U$35  [#VIN#13]  19.05,61.85 270 top
U$36  [#INT#10]  8.89,61.85 90 bottom
U$37  [#PPS#3]  6.35,61.72 270 top
U$38  [#TXO2#10]  47.12,60.96 270 top
U$39  [#BYP#8]  5.36,22.28 0 top
U$40  [#RXI2#10]  44.45,61.47 270 top
U$41  [MICROMOD_MI_LOGO_1]  12.7,21.59 0 top
U$42  [#MEAS#10]  8.64,5.21 270 top
U$43  [BOOT10]  15.75,28.96 270 top
U$44  [ZED#F9P19]  21.21,28.19 0 bottom
U$45  [GNSS21]  35.56,27.94 0 bottom
U$46  [#CLK#7]  21.59,61.72 90 bottom
U$47  [#SDO#9]  34.29,61.59 90 bottom
U$48  [#EN#0]  19.56,9.4 0 top
U$49  [U#CENTER20]  3.81,49.28 0 top
U$50  [QWIIC_5.5MM]  53.85,50.04 0 top
U$51  [#SWD#10]  20.11,4.83 0 top
U$52  [PROCESSOR23]  2.95,11.48 90 bottom
U$53  [#SDI#11]  31.75,61.85 90 bottom
U$54  [BLUETOOTH24]  42.93,49.91 0 bottom
U$55  [#NC#4]  39.39,62.08 270 top
U$56  [U#CENTER22]  2.92,54.86 90 bottom
U$57  [#A0#14]  38.13,3.76 90 bottom
U$58  [L1#L217]  52.96,38.23 0 bottom
U$59  [ANTENNA17]  52.32,27.94 0 bottom
U$60  [PPS16]  52.58,20.32 0 bottom
U$61  [##ZED_RESET##9]  13.97,59.05 270 top
U$62  [##ZED_RESET##14]  13.97,59.05 90 bottom
U$63  [SFE_LOGO_FLAME_.3]  19.05,22.86 0 top
U$64  [#GND#0]  48.29,4.29 270 top
U$65  [#GND#0]  35.53,4.24 270 top
U$66  [#GND#0]  35.53,4.22 90 bottom
U$67  [#A0#8]  38.13,3.76 270 top
U$68  [VIN3]  5.54,29.59 270 top
U$69  [3V34]  5.54,25.58 270 top
U$70  [#A1#8]  40.67,3.53 270 top
U$71  [#D1#8]  43.21,3.48 270 top
U$72  [#D2#8]  45.69,3.63 270 top
U$73  [PROCESSOR23]  3.96,5.74 0 top
U$74  [#A1#14]  40.64,3.53 90 bottom
U$75  [#D1#14]  43.21,3.48 90 bottom
U$76  [#D2#14]  45.69,3.63 90 bottom
U$77  [#GND#0]  48.29,4.24 90 bottom
U$78  [#GND#0]  48.29,4.24 270 top
U$79  [GNSS501]  21.46,57.15 0 top
U$80  [CARRIER502]  29.97,57.28 0 top
U$81  [BOARD503]  38.61,57.28 0 top
U$82  [2222501]  51.31,6.35 270 top
U$83  [#NC#4]  49.54,62.05 270 top
U$84  [#NC#5]  39.39,62.08 90 bottom
U$85  [#NC#5]  49.54,62.05 90 bottom
U$131  [#SWD#10]  20.13,4.83 0 bottom
U$132  [#MEAS#10]  8.64,5.21 90 bottom
U$133  [#VIN_LED#10]  6.35,29.59 0 bottom
U$134  [#3V3_LED#10]  6.6,25.78 0 bottom
VIN  2.1,29.59 90 bottom

### Tracks (layer width: path | path; a pad name or v marks a point on that pad's centre or on a via)
3.3V  (via drill 0.3, 0.38)
  Top 0.178: MEAS.4 MEAS.2
  Top 0.254: J6.2 34.02,6.49 v34.04,6.48 | D2.A 2.2,24.9 6.6,20.5 v6.6,19.05 | D11.A 12.6,46.54 13.31,47.25 15.6,47.25 22.9,54.56 24.43,54.56 v24.49,54.61 | J6.74 34.02,24.49 34.04,24.51 | D7.A 34.09,22.4 34.04,22.35
  Top 0.508: C5.1 15.84,3.98 17.2,5.33 22.71,5.33 22.73,5.31 | v30.73,53.09 31.71,53.09 C3.1 | U1.38 31.92,53.03 C3.1 | C3.1 R22.2 | U1.33 37.42,53.03 C4.1 37.43,53.09 v36.32,53.09 v36.32,53.08 U1.34 | J8.1 22.73,5.31 | 22.73,5.31 v22.76,5.33 | v34.04,6.48 34.04,22.35 34.04,24.51 34.04,25.4 v34.14,25.5 | v42.04,60.4 v42.04,53.14 | v50.47,53.14 50.47,53.52 51.06,54.11 J5.2
  Top 0.762: C5.1 C6.1 C7.1 10.38,3.98 MEAS.4
  Bottom 0.254: MEAS.4 10.03,4.19 6.6,7.62 v6.6,19.05
  Bottom 0.508: v34.04,6.48 34.04,5.33 32.64,3.94 26.82,3.94 25.43,5.33 v22.76,5.33 | 25.72,52.51 24.77,51.56 24.77,33.53 32.79,25.5 v34.14,25.5 | 25.72,52.51 26.29,53.09 v30.73,53.09 30.76,53.11 36.3,53.11 v36.32,53.09 36.35,53.11 42.01,53.11 v42.04,53.14 v50.47,53.14 | J10.9 24.49,62.08 v24.49,54.61 24.49,53.75 25.72,52.51 | v42.04,60.4 41.91,60.53 J9.3
3.3V_EN
  Top 0.254: U5.5 12.93,11.71 D1.C 13.44,10.81 15.02,9.22 R5.1 16.5,9.29 EN.1
!BOOT!  (via drill 0.3)
  Top 0.254: J6.11 22.52,8.74 18.8,12.47 v18.8,14.43 | S2.4 S2.3 14.35,25.91 18.8,21.46 v18.8,15.77
  Bottom 0.254: v18.8,15.77 18.82,15.75 18.82,14.45 v18.8,14.43
!RESET!  (via drill 0.3)
  Top 0.254: J8.10 18.52,0.91 24.26,0.91 28.19,4.85 28.19,6.27 29.96,8.04 | J6.6 30.5,7.49 29.96,8.04 | 29.96,8.04 28.29,9.7 28.29,17.13 v28.12,17.3 | v23.37,19.24 22.16,19.24 16.46,24.94 16.46,33.78 16.08,34.16 S1.3 S1.4
  Bottom 0.254: v23.37,19.24 23.8,18.8 26.23,18.8 27.74,17.3 v28.12,17.3
!SAFEBOOT!  (via drill 0.3)
  Top 0.254: R11.P7 20.45,41.81 v20.43,41.79
  Bottom 0.254: v20.43,41.79 20.43,44.09 15.8,48.73 15.8,58.57 11.43,62.94 J10.3
!ZED_RESET!  (via drill 0.3)
  Top 0.254: v20.94,42.63 20.94,42.67 21,42.61 R11.P6
  Bottom 0.254: v20.94,42.63 20.8,42.77 20.8,44.23 16.15,48.88 16.15,59 13.95,61.21 13.95,64.24 J10.4
A0  (via drill 0.3)
  Top 0.254: J6.34 31.49,14.49 v31.04,14.05 | v36.32,14.22 36.32,7.21 38.1,5.44 J7.2
  Bottom 0.254: v36.32,14.22 36.25,14.3 31.29,14.3 v31.04,14.05
A1  (via drill 0.3)
  Top 0.254: J6.38 31.14,15.49 v30.96,15.67 | J7.3 40.64,3.65 36.83,7.46 36.83,14.99 v36.32,15.49
  Bottom 0.254: v30.96,15.67 31.14,15.49 v36.32,15.49
D1  (via drill 0.3)
  Top 0.254: J6.18 32.47,10.46 v31.24,10.46 | J7.4 43.18,1.88 37.34,7.72 v37.34,10.41
  Bottom 0.254: v37.34,10.41 37.29,10.46 v31.24,10.46
D_SEL  (via drill 0.38)
  Top 0.254: U1.47 25.69,44.45 v24.05,44.45
  Bottom 0.254: v24.05,44.45 23.8,44.45 23.79,44.46 23.61,44.46 23.16,44.91 SPI.1
G0/D2  (via drill 0.3)
  Top 0.254: v30.99,16.54 31.53,15.99 J6.40 | J7.5 45.72,1.6 44.15,3.17 42.55,3.17 37.85,7.87 37.85,15.06 36.88,16.03 v36.8,16.03
  Bottom 0.254: v36.8,16.03 31.5,16.03 v30.99,16.54
GEO_STAT  (via drill 0.3)
  Top 0.254: U1.19 46.36,41.28 50.55,45.47 50.55,50.54 49.78,51.3 v49.78,54.81 | v25.17,58.93 15.09,58.93 13.72,57.56 v13.72,57.23 | v15.75,45.82 15.75,43.43 14.66,42.34 10.13,42.34 6.35,38.56 6.35,35.56 5.87,35.08 2.84,35.08 D10.A
  Bottom 0.254: v49.78,54.81 49.48,55.12 28.98,55.12 v25.17,58.93 | v13.72,57.23 13.64,57.15 13.64,48.62 15.75,46.51 v15.75,45.82
GND  (via drill 0.3)
  Top 0.254: D4.2 8.69,54.89 v7.57,54.89 | J6.36 31.21,14.99 31.1,14.88 v31.04,14.88
  Top 0.508: J3.GND2 7.02,51.51 R7.1 | R2.1 7.46,14.65 J1.GND | R6.1 7.56,57.96 J3.GND | J1.GND2 6.49,8.21 R3.1
  other vias: 7.37,5.21 11.3,8 10.41,10.13 11.68,10.16 9.14,10.16 12.45,7.11 13.84,7.11 17.32,13.39 12.5,14.12 12.94,18.54 26.29,7.75 23.7,24.74 26.37,24.74 15.37,7.11 26.44,14.22 23.52,14.22 26.44,17.22 44.27,50.57 27.25,51.33 37.92,49.56 37.92,47.52 37.92,45.49 37.92,43.46 37.92,41.43 37.92,39.4 37.92,37.36 39.95,37.36 39.95,39.4 39.95,41.43 39.95,43.46 39.95,45.49 39.95,47.52 39.95,49.56 41.99,49.56 42.24,47.52 42.24,45.49 42.24,43.46 42.24,41.43 42.24,39.4 42.24,37.36 44.27,37.36 44.27,39.4 44.27,41.43 44.27,43.46 44.27,45.49 44.27,47.52 35.64,49.56 35.64,47.52 35.64,45.49 35.64,43.46 35.64,41.43 35.64,39.4 35.64,37.36 33.6,37.36 31.57,37.36 29.46,37.41 29.54,39.4 29.54,41.43 29.54,43.46 29.54,45.49 29.54,47.52 29.54,49.56 31.57,49.56 31.57,47.52 31.57,45.49 31.57,43.46 31.57,41.43 31.57,39.4 33.6,39.4 33.6,41.43 33.6,43.46 33.6,45.49 33.6,47.52 33.6,49.56 27.25,37.36 27.25,39.4 27.25,41.43 27.25,43.46 27.25,45.49 27.25,47.52 27.25,49.56 44.27,35.59 28.52,34.06 28.52,32.79 28.52,31.78 29.03,30.76 30.05,30 31.32,29.24 32.84,29.24 34.37,29.24 36.14,29.24 37.67,29.24 39.45,29.24 40.72,30 41.48,30.81 43.13,31.78 45.16,31.78 46.05,31.78 47.32,31.78 49.61,31.78 48.34,34.32 47.32,34.32 46.05,34.32 44.78,34.32 43.51,34.32 42.11,34.24 40.97,33.81 39.95,33.05 38.94,32.28 37.67,31.78 36.4,31.78 32.33,31.78 31.32,32.28 30.86,33.17 42.37,31.52 12.52,50.06 12.52,52.6 12.78,57.18 10.24,57.18 10.24,59.21 7.44,60.48 4.65,48.79 9.98,52.6 9.98,50.06 7.37,49.28 4.32,44.96 4.32,42.93 12.52,47.78 55.7,38.63 53.92,37.36 51.89,37.36 49.86,37.36 49.48,27.58 50.88,28.6 53.92,28.6 55.07,27.33 48.34,27.46 48.34,28.98 49.61,30.25 49.61,34.32 49.73,35.84 48.34,38.63 55.7,41.17 55.7,43.97 55.7,46.25 55.7,48.79 51.89,41.17 51.89,43.97 51.89,46.25 51.89,48.79 53.92,41.17 53.92,43.97 53.92,46.25 53.92,48.79 49.86,41.17 49.86,43.97 48.34,41.17 51.64,24.66 52.93,14.94 49.61,19.84 46.35,27.36 42.88,27.3 39.12,27.43 35.31,27.43 32,27.43 46.48,28.96 46.48,30.23 42.93,30.23 41.15,28.88 44.7,27.3 33.53,27.43 32.08,57.43 34.62,57.43 37.92,57.18 35.13,53.87 40.72,53.87 40.72,57.18 43.26,57.18 46.81,57.18 49.86,57.18 53.67,57.43 55.7,55.91 27,35.59 2.29,42.93 6.6,42.93 6.6,40.64 18.62,54.13 20.9,54.13 18.87,52.1 17.6,60.22 20.9,60.22 43.36,59.46 43.26,62 45.29,59.46 44.78,62 26.75,54.13 30.18,53.92 23.95,51.08 19.63,34.32 19.63,31.78 19.63,29.49 19.63,27.2 21.92,24.66 21.92,29.49 21.92,27.2 23.95,28.88 24.46,27.2 21.92,30.76 23.19,22.63 41.73,19.84 37.92,19.84 41.73,17.04 37.92,17.04 41.73,14.5 38.68,14.25 41.73,11.96 38.68,11.71 41.73,9.68 38.68,9.42 41.73,7.14 35.1,7.37 43.18,5.21 35.66,12.24 45.8,20.47 45.8,17.04 45.8,14.5 45.8,11.96 45.8,9.68 45.8,7.14 45.8,4.85 49.61,7.14 55.96,7.14 49.61,17.04 55.93,15.54 49.61,4.85 49.61,1.55 55.88,14.43 55.96,12.22 55.96,9.93 12.78,23.65 8.97,23.65 12.78,21.11 8.97,21.11 17.09,21.11 17.09,18.57 17.09,16.28 12.94,16.26 8.97,28.22 8.97,25.68 8.97,31.01 8.97,33.55 8.97,36.35 8.97,38.89 12.52,39.9 12.45,26.67 40.72,59.46 43.51,53.87 47.07,53.87 51.89,51.08 53.92,51.08 53.92,53.62 55.7,53.62 55.7,60.22 53.67,60.22 51.54,60.35 49.76,60.35 51.66,57.45 47.73,60.35 47.73,62.38 49.76,62.38 44.27,52.1 47.07,52.1 47.07,50.83 41.15,27.43 37.34,27.43 44.7,30.23 35.31,25.15 37.08,25.15 45.92,22.73 33.6,1.55 29.79,1.55 36.65,59.72 34.11,59.72 38.43,61.75 34.62,61.75 31.83,61.75 27.25,61.75 29.54,61.75 29.54,59.46 27.25,59.46 31.83,60.48 46.05,35.59 27,34.06 27,32.54 25.48,34.06 25.48,35.59 36.4,33.55 37.67,33.55 39.19,34.06 19.81,49.17 5.41,37.36 5.41,33.55 16.33,10.69 50.47,54.76 7.35,16.05 23.8,37.16 8.71,2.31 23.52,17.27 19.51,57.56 8.71,45.24 26.44,11.68 26.54,23.27 53.92,55.91 48.34,45.75 23.52,46.33 53.67,24.66 55.45,25.93 53.67,25.93 51.64,25.93 55.96,4.85 14.55,1.3 10.24,1.3 6.43,1.3 47.83,24.79
  pour Top (isolate 0.203, rank 4): 0,0 0,66.04 56.9,66.04 56.9,0
  pour Bottom (isolate 0.203, rank 4): 0,0 0,66.04 56.9,66.04 56.9,0
INT  (via drill 0.3)
  Top 0.254: R11.P8 19.97,41.01 v19.91,41.07 19.91,37.74 31.24,26.42 34.29,26.42 34.8,25.91 v34.8,23.11 | v34.8,21.84 v34.8,9.91 | J6.16 31.54,9.99 31.45,9.91 30.81,9.91 v30.52,10.2
  Bottom 0.254: v19.91,41.07 19.91,44.11 15.44,48.58 15.44,58.22 9.4,64.26 J10.2 | v34.8,23.11 v34.8,21.84 | v30.52,10.2 30.81,9.91 v34.8,9.91
N$1
  Top 0.254: R1.2 2.27,26.48 D2.C
N$2  (via drill 0.3)
  Top 0.254: R4.1 4.15,28.7 v5.08,28.7
  Bottom 0.254: v5.08,28.7 4.71,29.07 VIN.1
N$3  (via drill 0.3)
  Top 0.254: R1.1 4.2,24.89 v5.08,24.89
  Bottom 0.254: v5.08,24.89 4.71,25.26 3V3.1
N$4
  Top 0.254: R4.2 2.25,30.31 D3.C
N$5  (via drill 0.3)
  Top 0.254: EN.2 19,9.4 22.2,6.2 v23.37,6.2 | v29.72,6.99 J6.4
  Bottom 0.254: v23.37,6.2 28.93,6.2 v29.72,6.99
N$6
  Top 0.254: J3.A5 7.28,55.99 R6.2
N$7
  Top 0.254: J3.B5 7.25,52.99 R7.2
N$8  (via drill 0.3)
  Top 0.254: R20.1 5.04,32.3 v5.08,32.26
  Bottom 0.254: v5.08,32.26 4.71,32.63 RTK.2
N$9
  Top 0.254: D4.6 10.67,55.36 10.8,55.5 R16.1
N$10
  Top 0.254: J1.A5 7.18,12.68 R2.2
N$11
  Top 0.254: J1.B5 6.71,9.68 R3.2
N$12
  Top 0.254: J3.A6 6.74,54.99 7.06,54.66 7.06,54.43 | 7.06,54.43 7.06,54.29 6.76,53.99 J3.B6 | 7.06,54.43 7.31,54.43 7.38,54.36 D4.3
N$13
  Top 0.254: D4.1 7.82,55.36 7.69,55.49 J3.B7 5.02,55.49 4.83,55.3 4.83,54.61 4.95,54.49 J3.A7
N$14
  Top 0.254: R8.1 40.4,25.53 D6.A 41.9,24.13 BT1.+
N$15
  Top 0.254: U1.51 24.23,40.18 R11.P1
N$16
  Top 0.254: R11.P2 24.35,41.81 24.88,41.28 U1.50
N$17
  Top 0.254: D4.4 10.72,54.36 10.8,54.28 11.64,54.28 R15.1
N$18
  Top 0.508: FB1.2 33.49,34.04 R17.1 33.52,32.49 C8.1
N$19
  Top 0.254: R11.P3 23.68,42.61 23.91,42.38 U1.49
N$20
  Top 0.254: U1.46 24.1,45.68 23.4,44.97 R11.P4
N$21
  Top 0.254: U1.45 23.84,46.78 R12.P1
N$22
  Top 0.254: U1.44 25.64,48.06 23.44,48.06 R12.P2
N$23
  Top 0.254: U1.43 25.66,48.82 R12.P3
N$24
  Top 0.254: U1.42 25.8,50.06 23.72,50.06 23.4,49.74 R12.P4
N$25
  Top 0.254: R13.P1 47.71,49.77 47.4,50.08 U1.27
N$26
  Top 0.254: R13.P2 47.63,48.98 U1.26
N$27  (via drill 0.3)
  Top 0.254: R19.1 5.09,39.66 v5.11,39.67
  Bottom 0.254: v5.11,39.67 4.8,39.98 PPS.2
N$28
  Top 0.254: D8.C 2.32,41.36 R19.2
N$29
  Top 0.254: R20.2 3.84,33.77 D9.C
N$32
  Top 0.254: D11.C 12.5,44.27 12.5,44.61 14.15,46.27 R24.2
N$45  (via drill 0.3)
  Top 0.254: R21.1 5.04,36.11 v5.08,36.07
  Bottom 0.254: v5.08,36.07 4.72,36.42 2.11,36.42 GEOF.2
N$46
  Top 0.254: R21.2 2.32,37.81 D10.C
OUT_MEAS
  Top 0.178: MEAS.3 MEAS.1
  pour Top (isolate 0.305, no thermals): 9.3,9.09 9.58,9.09 9.58,8.61 11.07,7.11 11.07,5.66 9.3,5.66
PPS  (via drill 0.3)
  Top 0.254: U1.53 24.81,37.98 23.67,39.12 v23.19,39.12 23.19,35.2 31.6,26.8 47.45,26.8 49.91,24.33 49.91,20.95 50.55,20.32 E1.SIG | v15.24,43.69 14.28,42.72 9.96,42.72 5.94,38.71 2.77,38.71 D8.A
  Bottom 0.254: v23.19,39.12 20.93,39.12 19.05,41 19.05,43.69 | J10.1 8.13,62.48 10.49,62.48 15.09,57.89 15.09,48.43 19.05,44.47 19.05,43.69 | 19.05,43.69 v15.24,43.69
RF_IN  (2 unrouted)
  Top 1: 29.72,34.8 29.72,33.02 arc90 32.26,30.48 38.1,30.48 arc53 40.39,31.62 41.04,32.28 arc-45 42.84,33.02 J4.SIG 44.12,33.02
  pour Top (isolate 0.305, no thermals): 29.34,36.2 29.34,34.7 30.1,34.7 30.1,36.2
RTC_3V  (via drill 0.3)
  Top 0.152: 37.94,23.98 D6.C
  Top 0.254: R8.2 38.09,25.48 D6.C 38.22,24 38.73,24 39.24,23.5 39.24,22.92 39.76,22.4 D7.C | v37.01,23.98 37.94,23.98 | J6.72 v31.33,23.99 v31.32,24
  Bottom 0.254: v31.32,24 36.83,24 | 36.83,24 36.98,24 v37.01,23.98 | TP1.1 36.83,24
RTK_STAT  (via drill 0.3)
  Top 0.254: U1.20 46.95,42.38 50.04,45.47 50.04,50.55 49.28,51.31 v49.28,54.28 | v25.15,58.22 24.79,58.57 15.34,58.57 14.22,57.45 v14.22,56.64 | v16.28,46.51 16.28,43.13 15.11,41.96 10.34,41.96 6.76,38.38 6.76,32.56 5.61,31.42 2.69,31.42 D9.A
  Bottom 0.254: v49.28,54.28 48.95,54.61 28.75,54.61 v25.15,58.22 | v16.28,46.51 14.07,48.72 14.07,56.49 v14.22,56.64
RXI2  (via drill 0.3)
  Top 0.254: R13.P7 48.82,48.9 48.39,49.32 48.39,57.78 45.59,60.58 45.59,62.74 44.45,63.88 J9.4 41.66,61.47 40.64,61.47 35.41,56.24 18.49,56.24 v18.24,55.98 | J6.22 30.77,11.49 30.43,11.83 30.43,20.24 28.98,21.69 28.98,27.94 19.28,37.64 19.28,42.6 21.51,44.83 v21.51,45.74
  Bottom 0.254: v21.51,45.74 17.88,49.38 17.88,55.63 v18.24,55.98
RXI/SDI  (via drill 0.3)
  Top 0.203: v23.11,53.16 23.11,52.07 22.61,51.56 22.61,50.7 22.23,50.32 21.74,50.32 21.49,50.06 21.49,49 21.67,48.82 R12.P6 22.45,48.82 22.58,48.69 22.58,46.69 22.45,46.56 20.75,46.56 17.78,43.59 17.78,25.88 22.92,20.74 J6.59 | v23.24,57.76 23.29,57.71 30.2,57.71 32.87,60.38 32.87,63.14 J10.11
  Top 0.254: J6.17 26.94,10.24 27.61,10.91 27.61,21.29 26.95,21.95 v26.42,21.95 | v26.44,20.73 26.42,20.74 J6.59
  Bottom 0.203: v23.11,53.16 23.11,57.63 v23.24,57.76
  Bottom 0.254: v26.42,21.95 26.44,21.92 v26.44,20.73
SCL/SCK  (via drill 0.3)
  Top 0.254: J6.14 30.5,9.49 29.51,10.49 29.51,19.09 v28.68,19.93 | v25.4,60.96 22.1,64.26 J10.7 | v49.66,55.6 50.47,55.6 50.98,56.11 J5.4 | R12.P8 20.91,47.22 v20.88,47.19 17.35,43.65 17.35,25.58 22.68,20.24 J6.57 26.18,20.24 26.26,20.17 26.5,20.17 v26.63,20.04
  Bottom 0.254: v28.68,19.93 28.56,20.04 v26.63,20.04 | J10.7 22.17,63.68 22.17,50.11 20.83,48.77 20.83,47.24 v20.88,47.19 | v49.66,55.6 49.61,55.65 29.18,55.65 25.4,59.44 v25.4,60.96
SDA/!CS!  (via drill 0.3)
  Top 0.203: 22.09,48.01 R12.P7
  Top 0.254: J6.12 30.36,8.98 29.15,10.19 29.15,18.62 v28.65,19.13 | v26.67,19.25 26.44,19.25 25.95,19.74 J6.55 22.37,19.74 16.87,25.25 16.87,43.89 20.98,48.01 v21.34,48.01 22.09,48.01 | J10.8 24.13,64.21 25.91,62.43 v25.91,61.72 | J5.3 52.82,55.11 53.14,55.42 53.14,56.34 52.6,56.87 50.83,56.87 v50.09,56.13
  Bottom 0.254: J10.8 22.61,62.74 22.61,49.89 21.34,48.62 v21.34,48.01 | v28.65,19.13 28.52,19.25 v26.67,19.25 | v50.09,56.13 29.46,56.13 25.91,59.69 v25.91,61.72
SWDCK  (via drill 0.3)
  Top 0.254: v23.62,11.18 23.69,11.24 J6.21
  Bottom 0.254: J8.4 21.46,1.32 22.02,0.76 23.37,0.76 24.13,1.52 24.13,3.52 22.86,4.79 22.23,4.79 21.69,5.32 21.69,10.54 22.33,11.18 v23.62,11.18
SWDIO  (via drill 0.3)
  Top 0.254: J6.23 23.17,11.74 v23.11,11.68 | J8.2 24.61,1.78 24.94,2.11 v24.94,2.54
  Bottom 0.254: J8.2 23.09,1.78 23.62,2.31 23.62,3.33 22.81,4.14 22.3,4.14 21.34,5.11 21.34,10.92 22.1,11.68 v23.11,11.68 | TP2.1 24.94,1.73 v24.94,2.54
TX_READY  (via drill 0.3)
  Top 0.254: v21.35,43.42 21.36,43.41 R11.P5 22.53,43.41 22.66,43.28 v22.66,36.32 | J6.10 30.22,8.49 28.78,9.93 28.78,17.45 27.99,18.24 27.99,27.36 v22.63,32.72
  Bottom 0.254: v21.35,43.42 21.26,43.5 21.26,44.27 16.51,49.02 J10.5 | v22.63,32.72 22.66,32.74 v22.66,36.32
TXO2  (via drill 0.3)
  Top 0.254: R13.P8 48.76,49.95 48.76,57.92 45.97,60.71 45.97,62.69 47.02,63.73 47.02,64.26 J9.5 46.99,64.87 46.79,65.08 46.3,65.56 43.97,65.56 43.23,64.82 43.23,63.55 41.53,61.85 40.51,61.85 35.26,56.59 18.01,56.59 v17.55,56.13 | v20.95,45.31 20.95,44.83 18.92,42.8 18.92,37.39 28.63,27.69 28.63,21.49 30,20.12 30,11.76 30.77,10.99 J6.20
  Bottom 0.254: v20.95,45.31 20.95,45.74 17.53,49.17 17.53,56.13 v17.55,56.13
TXO/SDO  (via drill 0.3)
  Top 0.203: v23.6,52.55 23.6,52.07 22.91,51.38 22.91,50.51 22.1,49.69 R12.P5 22.16,49.62 22.91,48.87 22.91,46.56 22.61,46.25 20.88,46.25 18.29,43.66 18.29,26.16 23.21,21.24 J6.61 | v23.65,57.23 23.82,57.4 30.33,57.4 33.17,60.25 33.17,63.12 34.29,64.24 J10.12
  Top 0.254: J6.19 26.49,10.74 27.18,11.43 27.18,20.95 26.89,21.24 J6.61
  Bottom 0.203: v23.65,57.23 23.6,57.17 v23.6,52.55
USB_N  (via drill 0.3)
  Top 0.254: J6.5 22.6,7.24 18.03,11.81 v17.63,11.81 | J1.A7 6.86,11.18 | 6.86,11.18 7.34,11.18 v7.37,11.2 | J1.B7 6.62,12.18 6.86,11.94 6.86,11.18
  Bottom 0.254: v7.37,11.2 8.36,12.19 17.25,12.19 v17.63,11.81
USB_P  (via drill 0.3, 0.38)
  Top 0.254: J6.3 22.34,6.74 18.01,11.07 v17.22,11.07 | v7.87,10.67 v7.86,10.68 J1.B6 4.81,10.69 4.57,10.92 4.57,11.43 4.82,11.68 J1.A6
  Bottom 0.254: v7.87,10.67 9.02,11.81 16.48,11.81 v17.22,11.07
V_BATT  (via drill 0.3, 0.38)
  Top 0.152: R24.1 14.17,44.53
  Top 0.254: 14.17,44.53 14.17,43.76 13.77,43.36 11.4,43.36 10.56,44.21 BT2.+ 10.16,44.59 v10.16,45.72 | R24.1 15.14,45.53 15.14,46.23 23.01,54.1 25.15,54.1 v26.92,52.32 | v34.72,52.38 34.55,52.38 34.12,51.94 U1.36
  Bottom 0.254: v34.72,52.38 26.98,52.38 v26.92,52.32 | v10.16,45.72 TP3.1
V_FUSE
  Top 0.508: 1.4,21.84 0.56,22.68 0.56,42.56 2.21,44.21 D12.C | D5.C 2.79,17.27 1.14,18.92 F2.1 1.14,21.59
  Top 0.559: BYP.1 1.8,22.25 1.4,21.84 1.14,21.59
V_RF
  Top 0.508: U1.7 R17.2
V_USB
  Top 0.254: J1.VBUS2 5.61,8.98 5.19,9.4 4.45,9.4 | J1.VBUS1 5.72,13.72 3.81,13.72
  Top 0.508: D5.A 3.81,14.85 3.81,13.72 3.81,10.03 4.45,9.4
V_USB_2  (via drill 0.3)
  Top 0.254: J3.VBUS2 5.5,52.29 4.57,53.22 | 4.57,56.52 4.94,56.52 5.61,57.19 J3.VBUS1 | D4.5 v11.05,54.86
  Top 0.508: J10.6 16.13,61.34 v10.16,61.34 3.94,61.34 2.54,59.94 2.54,56.52 | 2.54,53.34 2.54,48.85 2.21,48.52 D12.A | 2.54,53.34 2.54,56.52 | 4.57,56.52 2.54,56.52 | 2.54,53.34 4.45,53.34 4.57,53.22
  Bottom 0.254: v11.05,54.86 11.05,60.45 v10.16,61.34
VIN
  Top 0.178: F2.2 4.14,19.53 3.95,19.34
  Top 0.254: 15.09,12.32 18.26,12.32 22.34,8.24 J6.9 | R5.2 15.09,12.32 | D3.A 1.27,27.89 1.27,24.26 2.03,23.5 2.54,23.5 2.87,23.16 2.87,22.28 BYP.2 | 9.44,12.32 14.4,12.32 | 14.4,12.32 15.09,12.32 | R10.2 14.4,13.4 14.4,12.32
  Top 0.508: C1.1 C13.1
  Top 0.559: C1.1 9.56,16.42 C2.+ 5.66,17.63 3.95,19.34 | BYP.2 3.63,22.25 4.14,21.74 F2.2
  pour Top (isolate 0.305, no thermals): 9.3,11.3 9.58,11.3 9.58,11.87 10.11,12.4 10.11,13.97 9.04,13.97 9.04,12.04 9.3,11.79
VIN/3
  Top 0.254: R10.1 15.85,15.1 R9.2 19.29,15.07 22.45,18.24 J6.49
ZED_USB_N
  Top 0.254: U1.39 30.54,51.21 30.54,52.49 27.41,55.63 18.8,55.63 18.2,55.02 15.15,55.02 14.67,55.5 R16.2
ZED_USB_P
  Top 0.254: U1.40 30.02,51.23 30.02,52.5 27.25,55.27 18.94,55.27 18.34,54.67 15.27,54.67 14.83,54.23 R15.2

### Text on the board
Bottom: v10
tPlace: - | + | - | +
tDocu: Elias Santistevan